# EAGLE design Flatsat v1 (EAGLE 9.6.2)
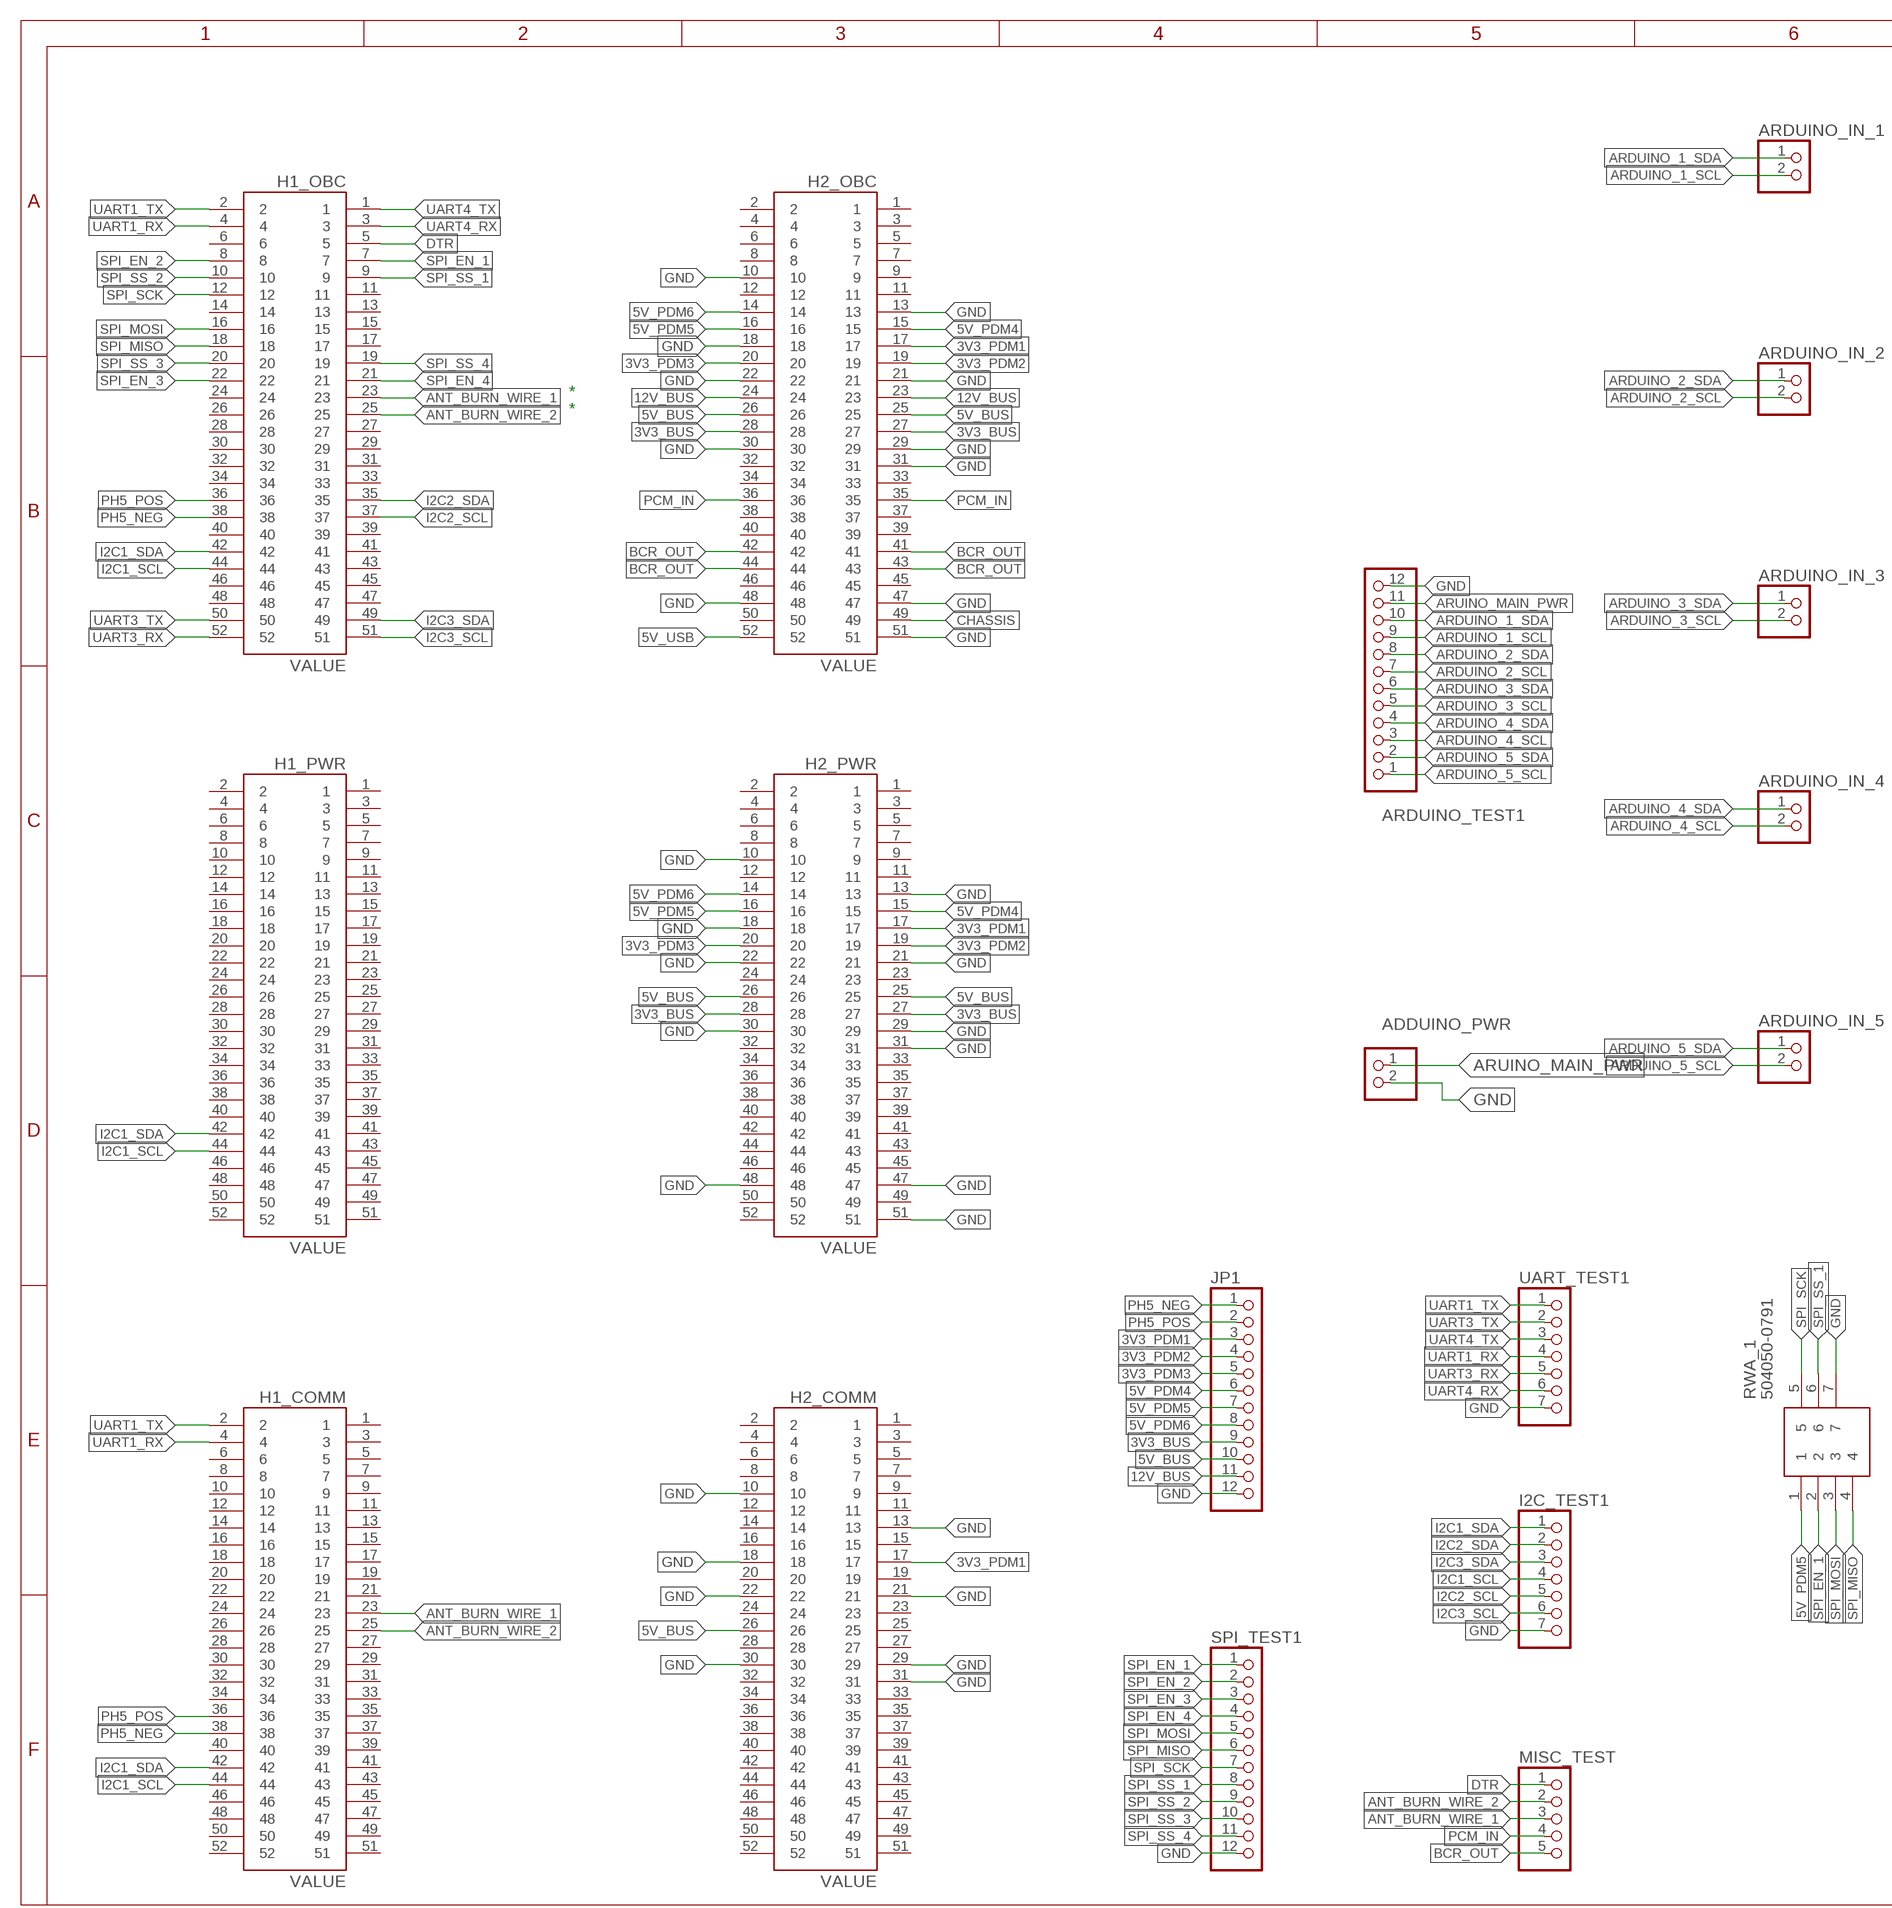
[diagram p0: schematic, sheet 1, part 1 of 2]
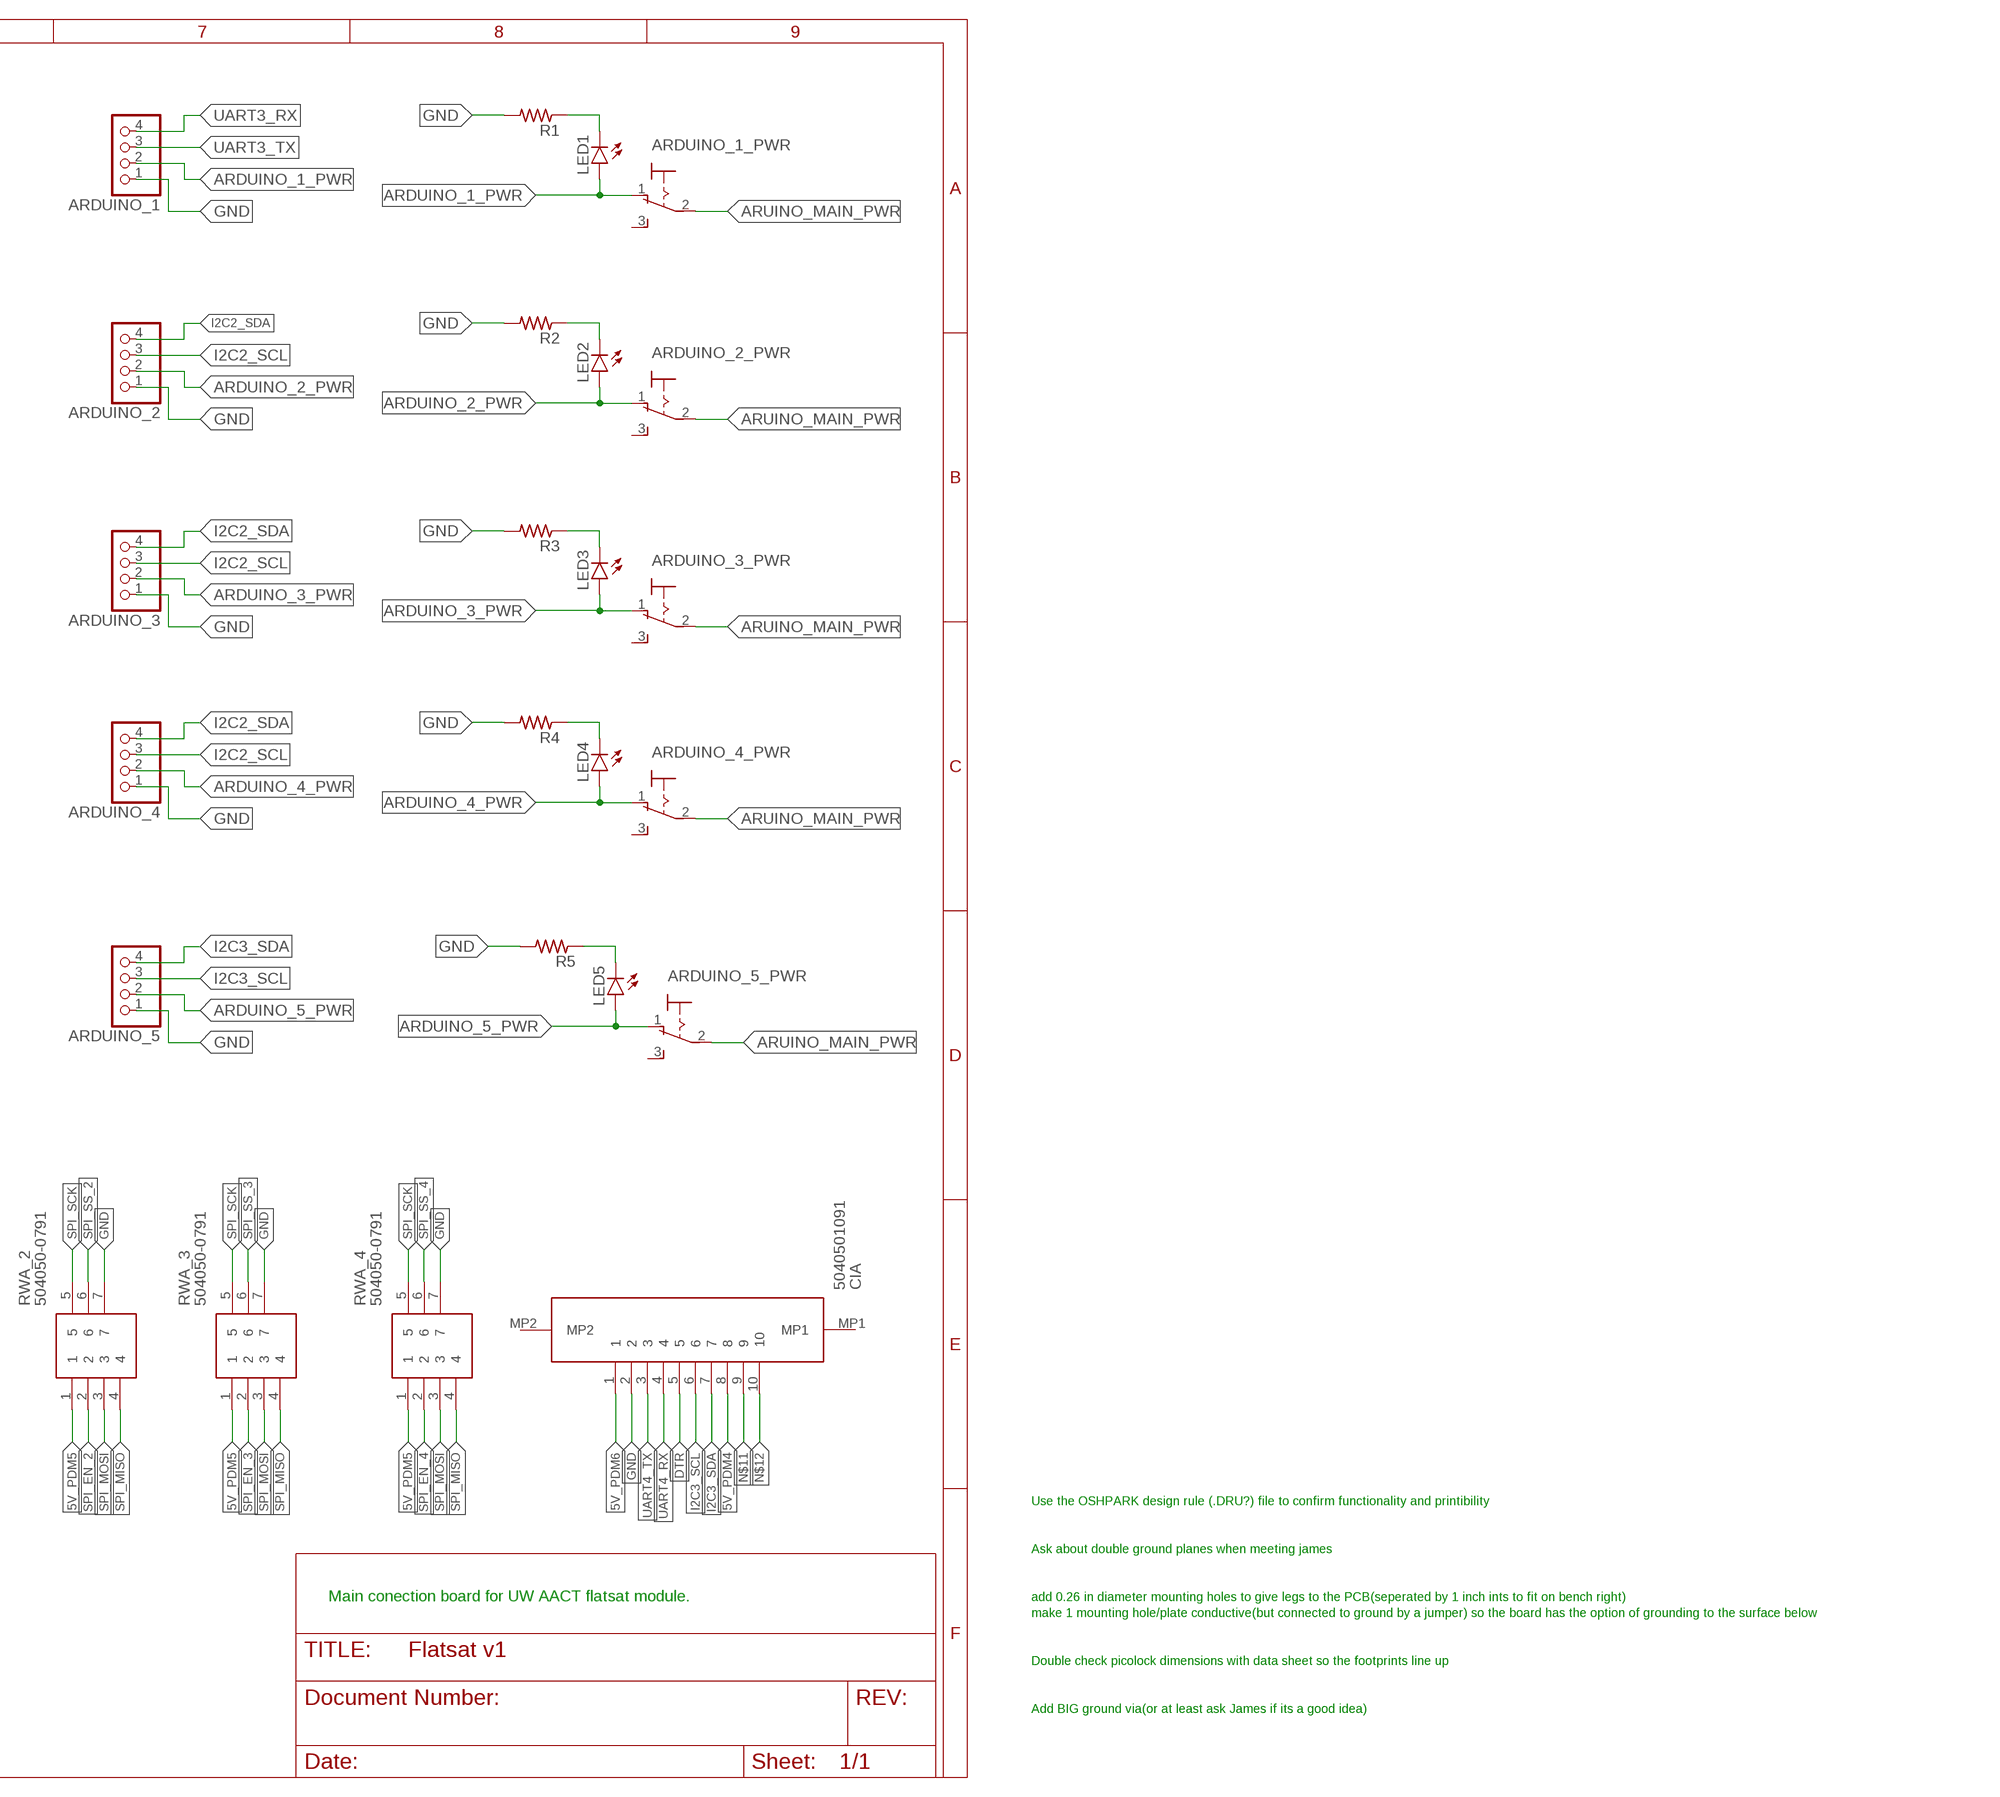
[diagram p1: schematic, sheet 1, part 2 of 2]

## Parts
ADDUINO_PWR  PINHD-1X2  [1X02]
ARDUINO_1  PINHD-1X4  [1X04]
ARDUINO_1_PWR  M9040P  [M9040P]
ARDUINO_2  PINHD-1X4  [1X04]
ARDUINO_2_PWR  M9040P  [M9040P]
ARDUINO_3  PINHD-1X4  [1X04]
ARDUINO_3_PWR  M9040P  [M9040P]
ARDUINO_4  PINHD-1X4  [1X04]
ARDUINO_4_PWR  M9040P  [M9040P]
ARDUINO_5  PINHD-1X4  [1X04]
ARDUINO_5_PWR  M9040P  [M9040P]
ARDUINO_IN_1  PINHD-1X2  [1X02]
ARDUINO_IN_2  PINHD-1X2  [1X02]
ARDUINO_IN_3  PINHD-1X2  [1X02]
ARDUINO_IN_4  PINHD-1X2  [1X02]
ARDUINO_IN_5  PINHD-1X2  [1X02]
ARDUINO_TEST1  PINHD-1X12  [1X12]
CIA  5040501091  [5040501091]
H1_COMM  ESQ-126-39-G-D_ESQ-126-39-G-D  [ESQ-126-39-G-D_SAMTEC_ESQ-126-39-G-D]
H1_OBC  ESQ-126-39-G-D_ESQ-126-39-G-D  [ESQ-126-39-G-D_SAMTEC_ESQ-126-39-G-D]
H1_PWR  ESQ-126-39-G-D_ESQ-126-39-G-D  [ESQ-126-39-G-D_SAMTEC_ESQ-126-39-G-D]
H2_COMM  ESQ-126-39-G-D_ESQ-126-39-G-D  [ESQ-126-39-G-D_SAMTEC_ESQ-126-39-G-D]
H2_OBC  ESQ-126-39-G-D_ESQ-126-39-G-D  [ESQ-126-39-G-D_SAMTEC_ESQ-126-39-G-D]
H2_PWR  ESQ-126-39-G-D_ESQ-126-39-G-D  [ESQ-126-39-G-D_SAMTEC_ESQ-126-39-G-D]
I2C_TEST1  PINHD-1X7  [1X07]
JP1  PINHD-1X12  [1X12]
LED1  TLLR4400  [LED3MM]
LED2  TLLR4400  [LED3MM]
LED3  TLLR4400  [LED3MM]
LED4  TLLR4400  [LED3MM]
LED5  TLLR4400  [LED3MM]
MISC_TEST  PINHD-1X5  [1X05]
R1  R-US_R0805W  [R0805W]
R2  R-US_R0805W  [R0805W]
R3  R-US_R0805W  [R0805W]
R4  R-US_R0805W  [R0805W]
R5  R-US_R0805W  [R0805W]
RWA_1  504050-0791  [504050-0791]
RWA_2  504050-0791  [504050-0791]
RWA_3  504050-0791  [504050-0791]
RWA_4  504050-0791  [504050-0791]
SPI_TEST1  PINHD-1X12  [1X12]
UART_TEST1  PINHD-1X7  [1X07]

## Nets
3V3_BUS [Power Line]: H2_OBC.27 H2_OBC.28 H2_PWR.27 H2_PWR.28 JP1.9
3V3_PDM1 [Power Line]: H2_COMM.17 H2_OBC.17 H2_PWR.17 JP1.3
3V3_PDM2 [Power Line]: H2_OBC.19 H2_PWR.19 JP1.4
3V3_PDM3 [Power Line]: H2_OBC.20 H2_PWR.20 JP1.5
5V_BUS [Power Line]: H2_COMM.26 H2_OBC.25 H2_OBC.26 H2_PWR.25 H2_PWR.26 JP1.10
5V_PDM4 [Power Line]: CIA.8 H2_OBC.15 H2_PWR.15 JP1.6
5V_PDM5 [Power Line]: H2_OBC.16 H2_PWR.16 JP1.7 RWA_1.1 RWA_2.1 RWA_3.1 RWA_4.1
5V_PDM6 [Power Line]: CIA.1 H2_OBC.14 H2_PWR.14 JP1.8
5V_USB [Power Line]: H2_OBC.52
12V_BUS [Power Line]: H2_OBC.23 H2_OBC.24 JP1.11
ANT_BURN_WIRE_1: H1_COMM.23 H1_OBC.23 MISC_TEST.3
ANT_BURN_WIRE_2: H1_COMM.25 H1_OBC.25 MISC_TEST.2
ARDUINO_1_PWR: ARDUINO_1.2 ARDUINO_1_PWR.1(O) LED1.A
ARDUINO_1_SCL [Signal Line]: ARDUINO_IN_1.2 ARDUINO_TEST1.9
ARDUINO_1_SDA [Signal Line]: ARDUINO_IN_1.1 ARDUINO_TEST1.10
ARDUINO_2_PWR [Signal Line]: ARDUINO_2.2 ARDUINO_2_PWR.1(O) LED2.A
ARDUINO_2_SCL: ARDUINO_IN_2.2 ARDUINO_TEST1.7
ARDUINO_2_SDA: ARDUINO_IN_2.1 ARDUINO_TEST1.8
ARDUINO_3_PWR [Signal Line]: ARDUINO_3.2 ARDUINO_3_PWR.1(O) LED3.A
ARDUINO_3_SCL: ARDUINO_IN_3.2 ARDUINO_TEST1.5
ARDUINO_3_SDA: ARDUINO_IN_3.1 ARDUINO_TEST1.6
ARDUINO_4_PWR [Signal Line]: ARDUINO_4.2 ARDUINO_4_PWR.1(O) LED4.A
ARDUINO_4_SCL: ARDUINO_IN_4.2 ARDUINO_TEST1.3
ARDUINO_4_SDA: ARDUINO_IN_4.1 ARDUINO_TEST1.4
ARDUINO_5_PWR [Signal Line]: ARDUINO_5.2 ARDUINO_5_PWR.1(O) LED5.A
ARDUINO_5_SCL: ARDUINO_IN_5.2 ARDUINO_TEST1.1
ARDUINO_5_SDA: ARDUINO_IN_5.1 ARDUINO_TEST1.2
ARUINO_MAIN_PWR [Power Line]: ADDUINO_PWR.1 ARDUINO_1_PWR.2(P) ARDUINO_2_PWR.2(P) ARDUINO_3_PWR.2(P) ARDUINO_4_PWR.2(P) ARDUINO_5_PWR.2(P) ARDUINO_TEST1.11
BCR_OUT: H2_OBC.41 H2_OBC.42 H2_OBC.43 H2_OBC.44 MISC_TEST.5
CHASSIS [Power Line]: H2_OBC.49
DTR: CIA.5 H1_OBC.5 MISC_TEST.1
GND [Power Line]: ADDUINO_PWR.2 ARDUINO_1.1 ARDUINO_2.1 ARDUINO_3.1 ARDUINO_4.1 ARDUINO_5.1 ARDUINO_TEST1.12 CIA.2 H2_COMM.10 H2_COMM.13 H2_COMM.18 H2_COMM.21 H2_COMM.22 H2_COMM.29 H2_COMM.30 H2_COMM.31 H2_OBC.10 H2_OBC.13 H2_OBC.18 H2_OBC.21 H2_OBC.22 H2_OBC.29 H2_OBC.30 H2_OBC.31 H2_OBC.47 H2_OBC.48 H2_OBC.51 H2_PWR.10 H2_PWR.13 H2_PWR.18 H2_PWR.21 H2_PWR.22 H2_PWR.29 H2_PWR.30 H2_PWR.31 H2_PWR.47 H2_PWR.48 H2_PWR.51 I2C_TEST1.7 JP1.12 R1.2 R2.2 R3.2 R4.2 R5.2 RWA_1.7 RWA_2.7 RWA_3.7 RWA_4.7 SPI_TEST1.12 UART_TEST1.7
I2C1_SCL [Signal Line]: H1_COMM.44 H1_OBC.44 H1_PWR.44 I2C_TEST1.4
I2C1_SDA [Signal Line]: H1_COMM.42 H1_OBC.42 H1_PWR.42 I2C_TEST1.1
I2C2_SCL [Signal Line]: ARDUINO_2.3 ARDUINO_3.3 ARDUINO_4.3 H1_OBC.37 I2C_TEST1.5
I2C2_SDA [Signal Line]: ARDUINO_2.4 ARDUINO_3.4 ARDUINO_4.4 H1_OBC.35 I2C_TEST1.2
I2C3_SCL [Signal Line]: ARDUINO_5.3 CIA.6 H1_OBC.51 I2C_TEST1.6
I2C3_SDA [Signal Line]: ARDUINO_5.4 CIA.7 H1_OBC.49 I2C_TEST1.3
N$1: LED2.K(C) R2.1
N$2: LED1.K(C) R1.1
N$3: LED3.K(C) R3.1
N$4: LED4.K(C) R4.1
N$5: LED5.K(C) R5.1
N$11: CIA.9
N$12: CIA.10
PCM_IN: H2_OBC.35 H2_OBC.36 MISC_TEST.4
PH5_NEG: H1_COMM.38 H1_OBC.38 JP1.1
PH5_POS: H1_COMM.36 H1_OBC.36 JP1.2
SPI_EN_1 [Signal Line]: H1_OBC.7 RWA_1.2 SPI_TEST1.1
SPI_EN_2 [Signal Line]: H1_OBC.8 RWA_2.2 SPI_TEST1.2
SPI_EN_3 [Signal Line]: H1_OBC.22 RWA_3.2 SPI_TEST1.3
SPI_EN_4 [Signal Line]: H1_OBC.21 RWA_4.2 SPI_TEST1.4
SPI_MISO: H1_OBC.18 RWA_1.4 RWA_2.4 RWA_3.4 RWA_4.4 SPI_TEST1.6
SPI_MOSI [Signal Line]: H1_OBC.16 RWA_1.3 RWA_2.3 RWA_3.3 RWA_4.3 SPI_TEST1.5
SPI_SCK [Signal Line]: H1_OBC.12 RWA_1.5 RWA_2.5 RWA_3.5 RWA_4.5 SPI_TEST1.7
SPI_SS_1 [Signal Line]: H1_OBC.9 RWA_1.6 SPI_TEST1.8
SPI_SS_2 [Signal Line]: H1_OBC.10 RWA_2.6 SPI_TEST1.9
SPI_SS_3 [Signal Line]: H1_OBC.20 RWA_3.6 SPI_TEST1.10
SPI_SS_4 [Signal Line]: H1_OBC.19 RWA_4.6 SPI_TEST1.11
UART1_RX: H1_COMM.4 H1_OBC.4 UART_TEST1.4
UART1_TX: H1_COMM.2 H1_OBC.2 UART_TEST1.1
UART3_RX: ARDUINO_1.4 H1_OBC.52 UART_TEST1.5
UART3_TX [Signal Line]: ARDUINO_1.3 H1_OBC.50 UART_TEST1.2
UART4_RX: CIA.4 H1_OBC.3 UART_TEST1.6
UART4_TX: CIA.3 H1_OBC.1 UART_TEST1.3
Unconnected: ARDUINO_1_PWR.3(S) ARDUINO_2_PWR.3(S) ARDUINO_3_PWR.3(S) ARDUINO_4_PWR.3(S) ARDUINO_5_PWR.3(S) CIA.MP1 CIA.MP2 H1_COMM.1 H1_COMM.3 H1_COMM.5 H1_COMM.6 H1_COMM.7 H1_COMM.8 H1_COMM.9 H1_COMM.10 H1_COMM.11 H1_COMM.12 H1_COMM.13 H1_COMM.14 H1_COMM.15 H1_COMM.16 H1_COMM.17 H1_COMM.18 H1_COMM.19 H1_COMM.20 H1_COMM.21 H1_COMM.22 H1_COMM.24 H1_COMM.26 H1_COMM.27 H1_COMM.28 H1_COMM.29 H1_COMM.30 H1_COMM.31 H1_COMM.32 H1_COMM.33 H1_COMM.34 H1_COMM.35 H1_COMM.37 H1_COMM.39 H1_COMM.40 H1_COMM.41 H1_COMM.43 H1_COMM.45 H1_COMM.46 H1_COMM.47 H1_COMM.48 H1_COMM.49 H1_COMM.50 H1_COMM.51 H1_COMM.52 H1_OBC.6 H1_OBC.11 H1_OBC.13 H1_OBC.14 H1_OBC.15 H1_OBC.17 H1_OBC.24 H1_OBC.26 H1_OBC.27 H1_OBC.28 H1_OBC.29 H1_OBC.30 H1_OBC.31 H1_OBC.32 H1_OBC.33 H1_OBC.34 H1_OBC.39 H1_OBC.40 H1_OBC.41 H1_OBC.43 H1_OBC.45 H1_OBC.46 H1_OBC.47 H1_OBC.48 H1_PWR.1 H1_PWR.2 H1_PWR.3 H1_PWR.4 H1_PWR.5 H1_PWR.6 H1_PWR.7 H1_PWR.8 H1_PWR.9 H1_PWR.10 H1_PWR.11 H1_PWR.12 H1_PWR.13 H1_PWR.14 H1_PWR.15 H1_PWR.16 H1_PWR.17 H1_PWR.18 H1_PWR.19 H1_PWR.20 H1_PWR.21 H1_PWR.22 H1_PWR.23 H1_PWR.24 H1_PWR.25 H1_PWR.26 H1_PWR.27 H1_PWR.28 H1_PWR.29 H1_PWR.30 H1_PWR.31 H1_PWR.32 H1_PWR.33 H1_PWR.34 H1_PWR.35 H1_PWR.36 H1_PWR.37 H1_PWR.38 H1_PWR.39 H1_PWR.40 H1_PWR.41 H1_PWR.43 H1_PWR.45 H1_PWR.46 H1_PWR.47 H1_PWR.48 H1_PWR.49 H1_PWR.50 H1_PWR.51 H1_PWR.52 H2_COMM.1 H2_COMM.2 H2_COMM.3 H2_COMM.4 H2_COMM.5 H2_COMM.6 H2_COMM.7 H2_COMM.8 H2_COMM.9 H2_COMM.11 H2_COMM.12 H2_COMM.14 H2_COMM.15 H2_COMM.16 H2_COMM.19 H2_COMM.20 H2_COMM.23 H2_COMM.24 H2_COMM.25 H2_COMM.27 H2_COMM.28 H2_COMM.32 H2_COMM.33 H2_COMM.34 H2_COMM.35 H2_COMM.36 H2_COMM.37 H2_COMM.38 H2_COMM.39 H2_COMM.40 H2_COMM.41 H2_COMM.42 H2_COMM.43 H2_COMM.44 H2_COMM.45 H2_COMM.46 H2_COMM.47 H2_COMM.48 H2_COMM.49 H2_COMM.50 H2_COMM.51 H2_COMM.52 H2_OBC.1 H2_OBC.2 H2_OBC.3 H2_OBC.4 H2_OBC.5 H2_OBC.6 H2_OBC.7 H2_OBC.8 H2_OBC.9 H2_OBC.11 H2_OBC.12 H2_OBC.32 H2_OBC.33 H2_OBC.34 H2_OBC.37 H2_OBC.38 H2_OBC.39 H2_OBC.40 H2_OBC.45 H2_OBC.46 H2_OBC.50 H2_PWR.1 H2_PWR.2 H2_PWR.3 H2_PWR.4 H2_PWR.5 H2_PWR.6 H2_PWR.7 H2_PWR.8 H2_PWR.9 H2_PWR.11 H2_PWR.12 H2_PWR.23 H2_PWR.24 H2_PWR.32 H2_PWR.33 H2_PWR.34 H2_PWR.35 H2_PWR.36 H2_PWR.37 H2_PWR.38 H2_PWR.39 H2_PWR.40 H2_PWR.41 H2_PWR.42 H2_PWR.43 H2_PWR.44 H2_PWR.45 H2_PWR.46 H2_PWR.49 H2_PWR.50 H2_PWR.52

## Notes on the sheet
- *
- *
- Use the OSHPARK design rule (.DRU?) file to confirm functionality and printibility
- Ask about double ground planes when meeting james
- Main conection board for UW AACT flatsat module. | add 0.26 in diameter mounting holes to give legs to the PCB(seperated by 1 inch ints to fit on bench right)
- make 1 mounting hole/plate conductive(but connected to ground by a jumper) so the board has the option of grounding to the surface below
- Double check picolock dimensions with data sheet so the footprints line up
- Add BIG ground via(or at least ask James if its a good idea)

## Library data of the parts
ADDUINO_PWR ARDUINO_IN_1-ARDUINO_IN_5 = pinhead:PINHD-1X2: PIN HEADER
ARDUINO_1-ARDUINO_5 = pinhead:PINHD-1X4: PIN HEADER
ARDUINO_1_PWR ARDUINO_2_PWR ARDUINO_3_PWR ARDUINO_4_PWR ARDUINO_5_PWR = switch:M9040P: TOGGLE SWITCH Marquardt
ARDUINO_TEST1 JP1 SPI_TEST1 = pinhead:PINHD-1X12: PIN HEADER
CIA = 5040501091:5040501091: 1.50mm Pitch, Pico-Lock PCB Header, Dual Row, Right-Angle, Surface Mount, Gold over Nickel Plating, Positive Lock, Circuits Source: Datasheet <https://www.molex.com/pdm_docs/sd/5040500691_sd.pdf>; ARROW_PART_NUMBER: 5040501091; ARROW_PRICE-STOCK: https://www.arrow.com/en/products/5040501091/molex; DESCRIPTION: 1.50mm Pitch, Pico-Lock PCB Header, Dual Row, Right-Angle, Surface Mount, Gold over Nickel Plating, Positive Lock, Circuits; HEIGHT: 2.15mm; MANUFACTURER_NAME: Molex; MANUFACTURER_PART_NUMBER: 5040501091
H1_COMM H1_OBC H1_PWR H2_COMM H2_OBC H2_PWR = EPS Flatsat Module2:ESQ-126-39-G-D_ESQ-126-39-G-D: Conn Elevated Socket SKT 52 POS 2.54mm Solder ST Thru-Hole Tube; DESCRIPTION: 52 Position Elevated Socket Connector Through Hole; DIGI-KEY_PART_NUMBER: SAM10462-ND; DIGI-KEY_PURCHASE_URL: https://www.digikey.com/product-detail/en/samtec-inc/ESQ-126-39-G-D/SAM10462-ND/3601055?utm_source=snapeda&utm_medium=aggregator&utm_campaign=symbol; MF: Samtec; MP: ESQ-126-39-G-D; PACKAGE: None
I2C_TEST1 UART_TEST1 = pinhead:PINHD-1X7: PIN HEADER
LED1-LED5 = led:TLLR4400: Low Current (2mA) LED 3 mm Tinted Diffused Package color RED Source: Data sheet <http://www.farnell.com/datasheets/391100.pdf>; MF: VISHAY SEMICONDUCTOR; OC_FARNELL: 1612437
MISC_TEST = pinhead:PINHD-1X5: PIN HEADER
R1-R5 = rcl:R-US_: RESISTOR, American symbol; SPICEPREFIX: R
RWA_1-RWA_4 = 504050-0791:504050-0791: Molex 504050 Series, 1.5mm Pitch 7 Way 1 Row Right Angle PCB Header, SMT Termination, 3A Source: Datasheet <https://componentsearchengine.com/Datasheets/3/504050-0791.pdf>; DESCRIPTION: Molex 504050 Series, 1.5mm Pitch 7 Way 1 Row Right Angle PCB Header, SMT Termination, 3A; HEIGHT: mm; MANUFACTURER_NAME: Molex; MANUFACTURER_PART_NUMBER: 504050-0791; MOUSER_PART_NUMBER: 538-504050-0791; MOUSER_PRICE-STOCK: https://www.mouser.co.uk/ProductDetail/Molex/504050-0791/?qs=bvCPb%252BE7ys0LP7A0OZeD8A%3D%3D

## Net classes
0 default: width 0.305 mm
1 Power Line: width 0.356 mm
2 Signal Line: width 0.254 mm

## Board
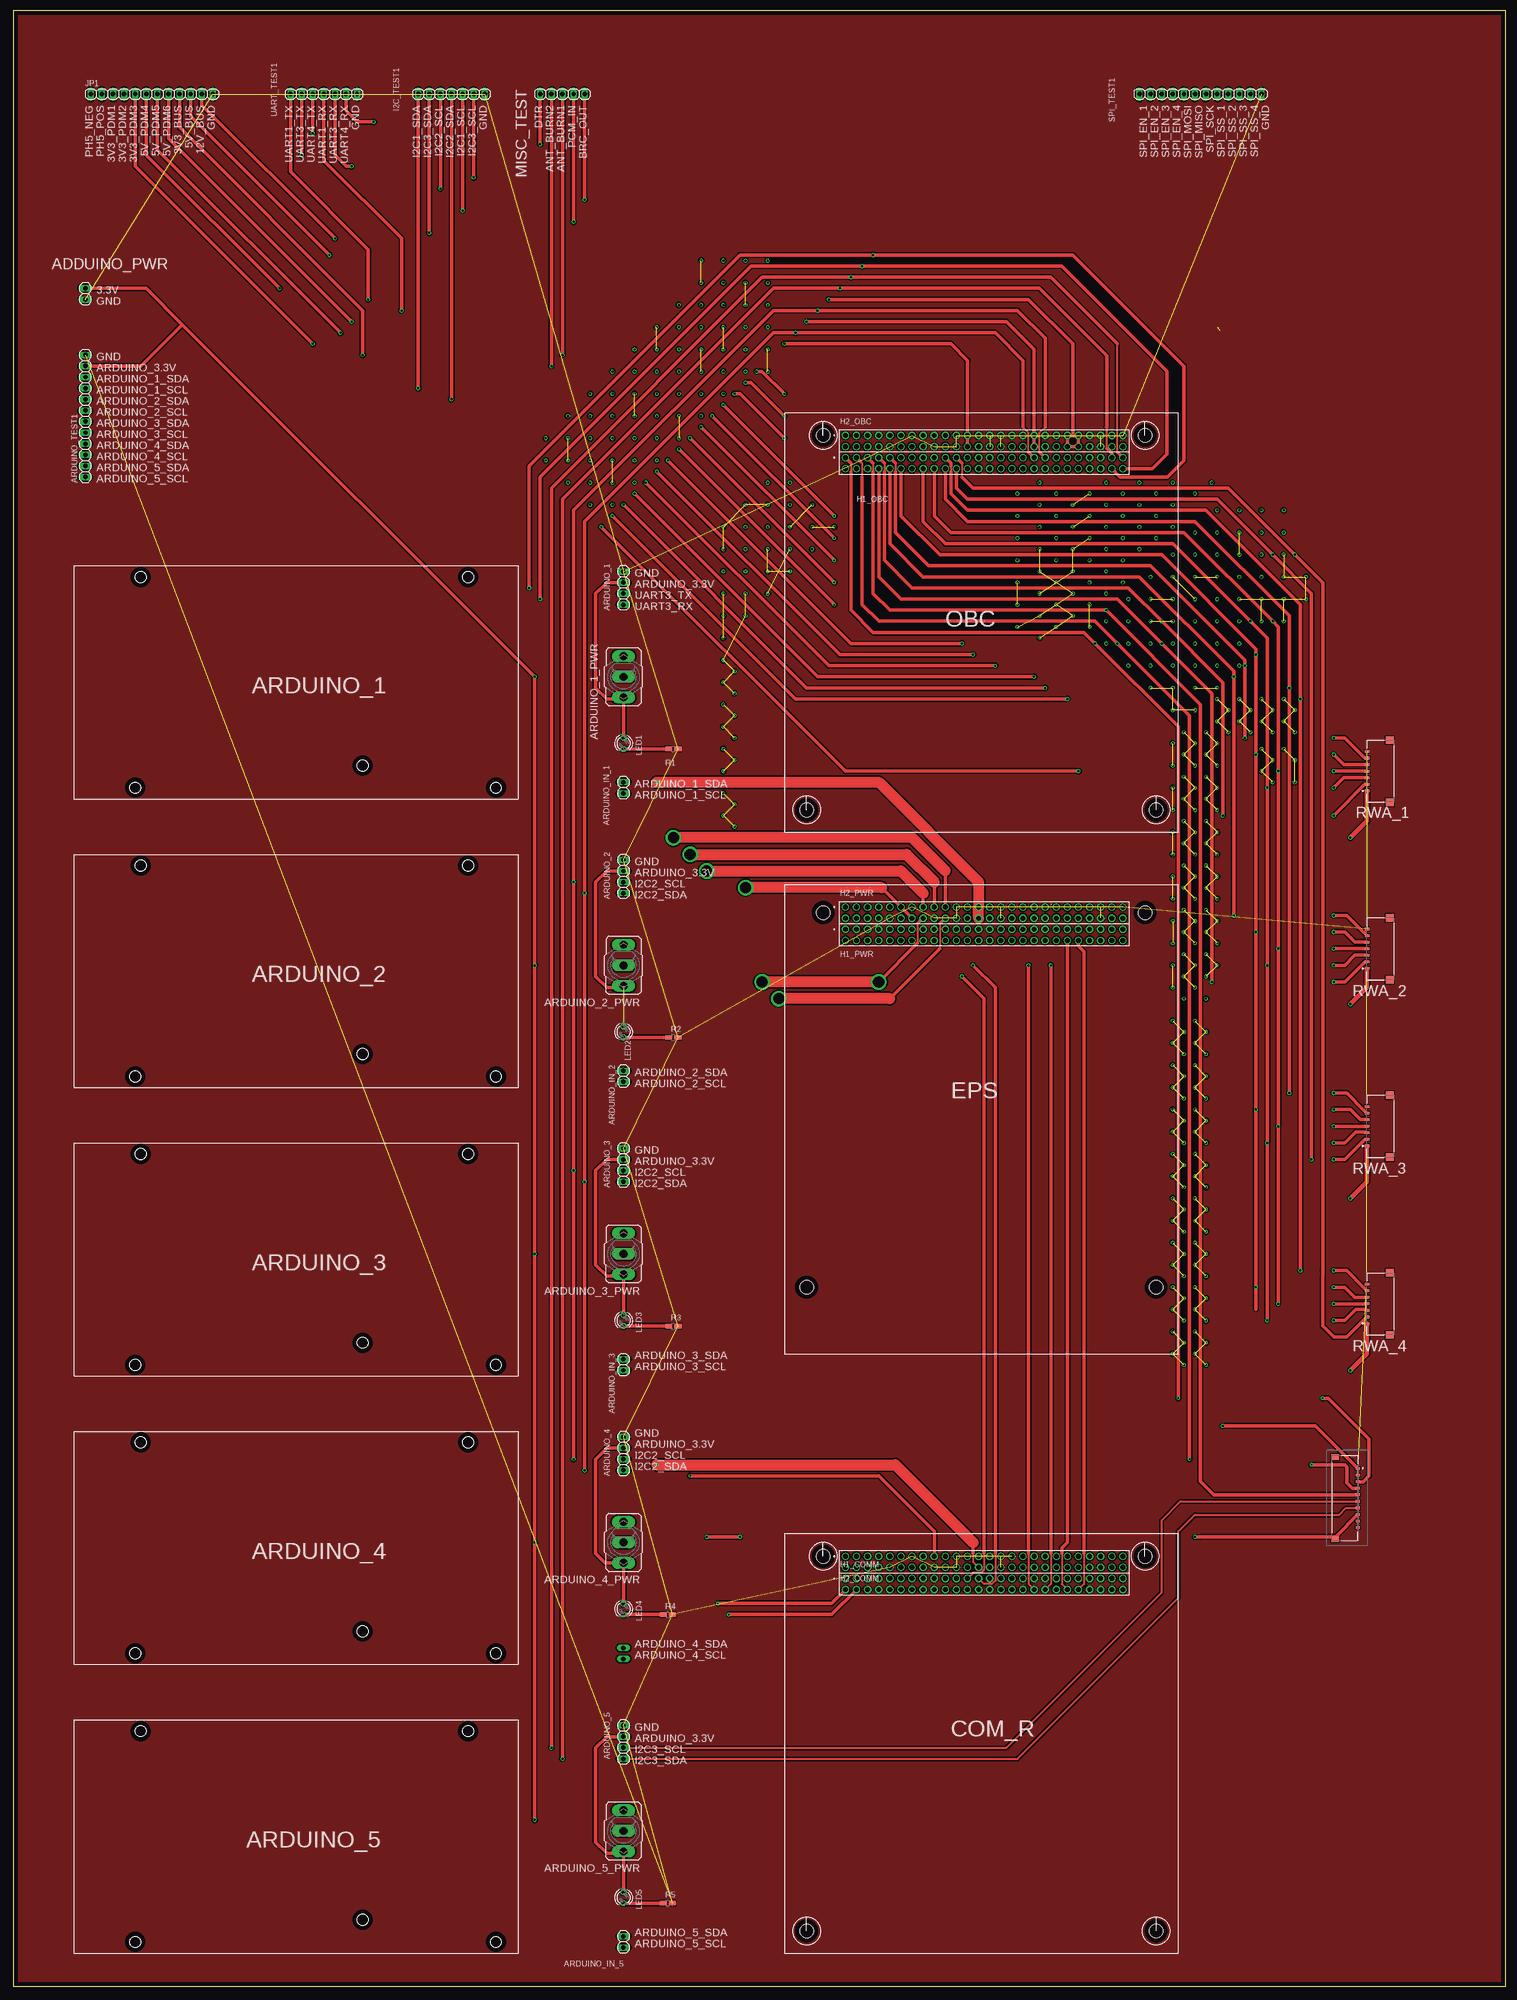
[diagram p2: board, top side]
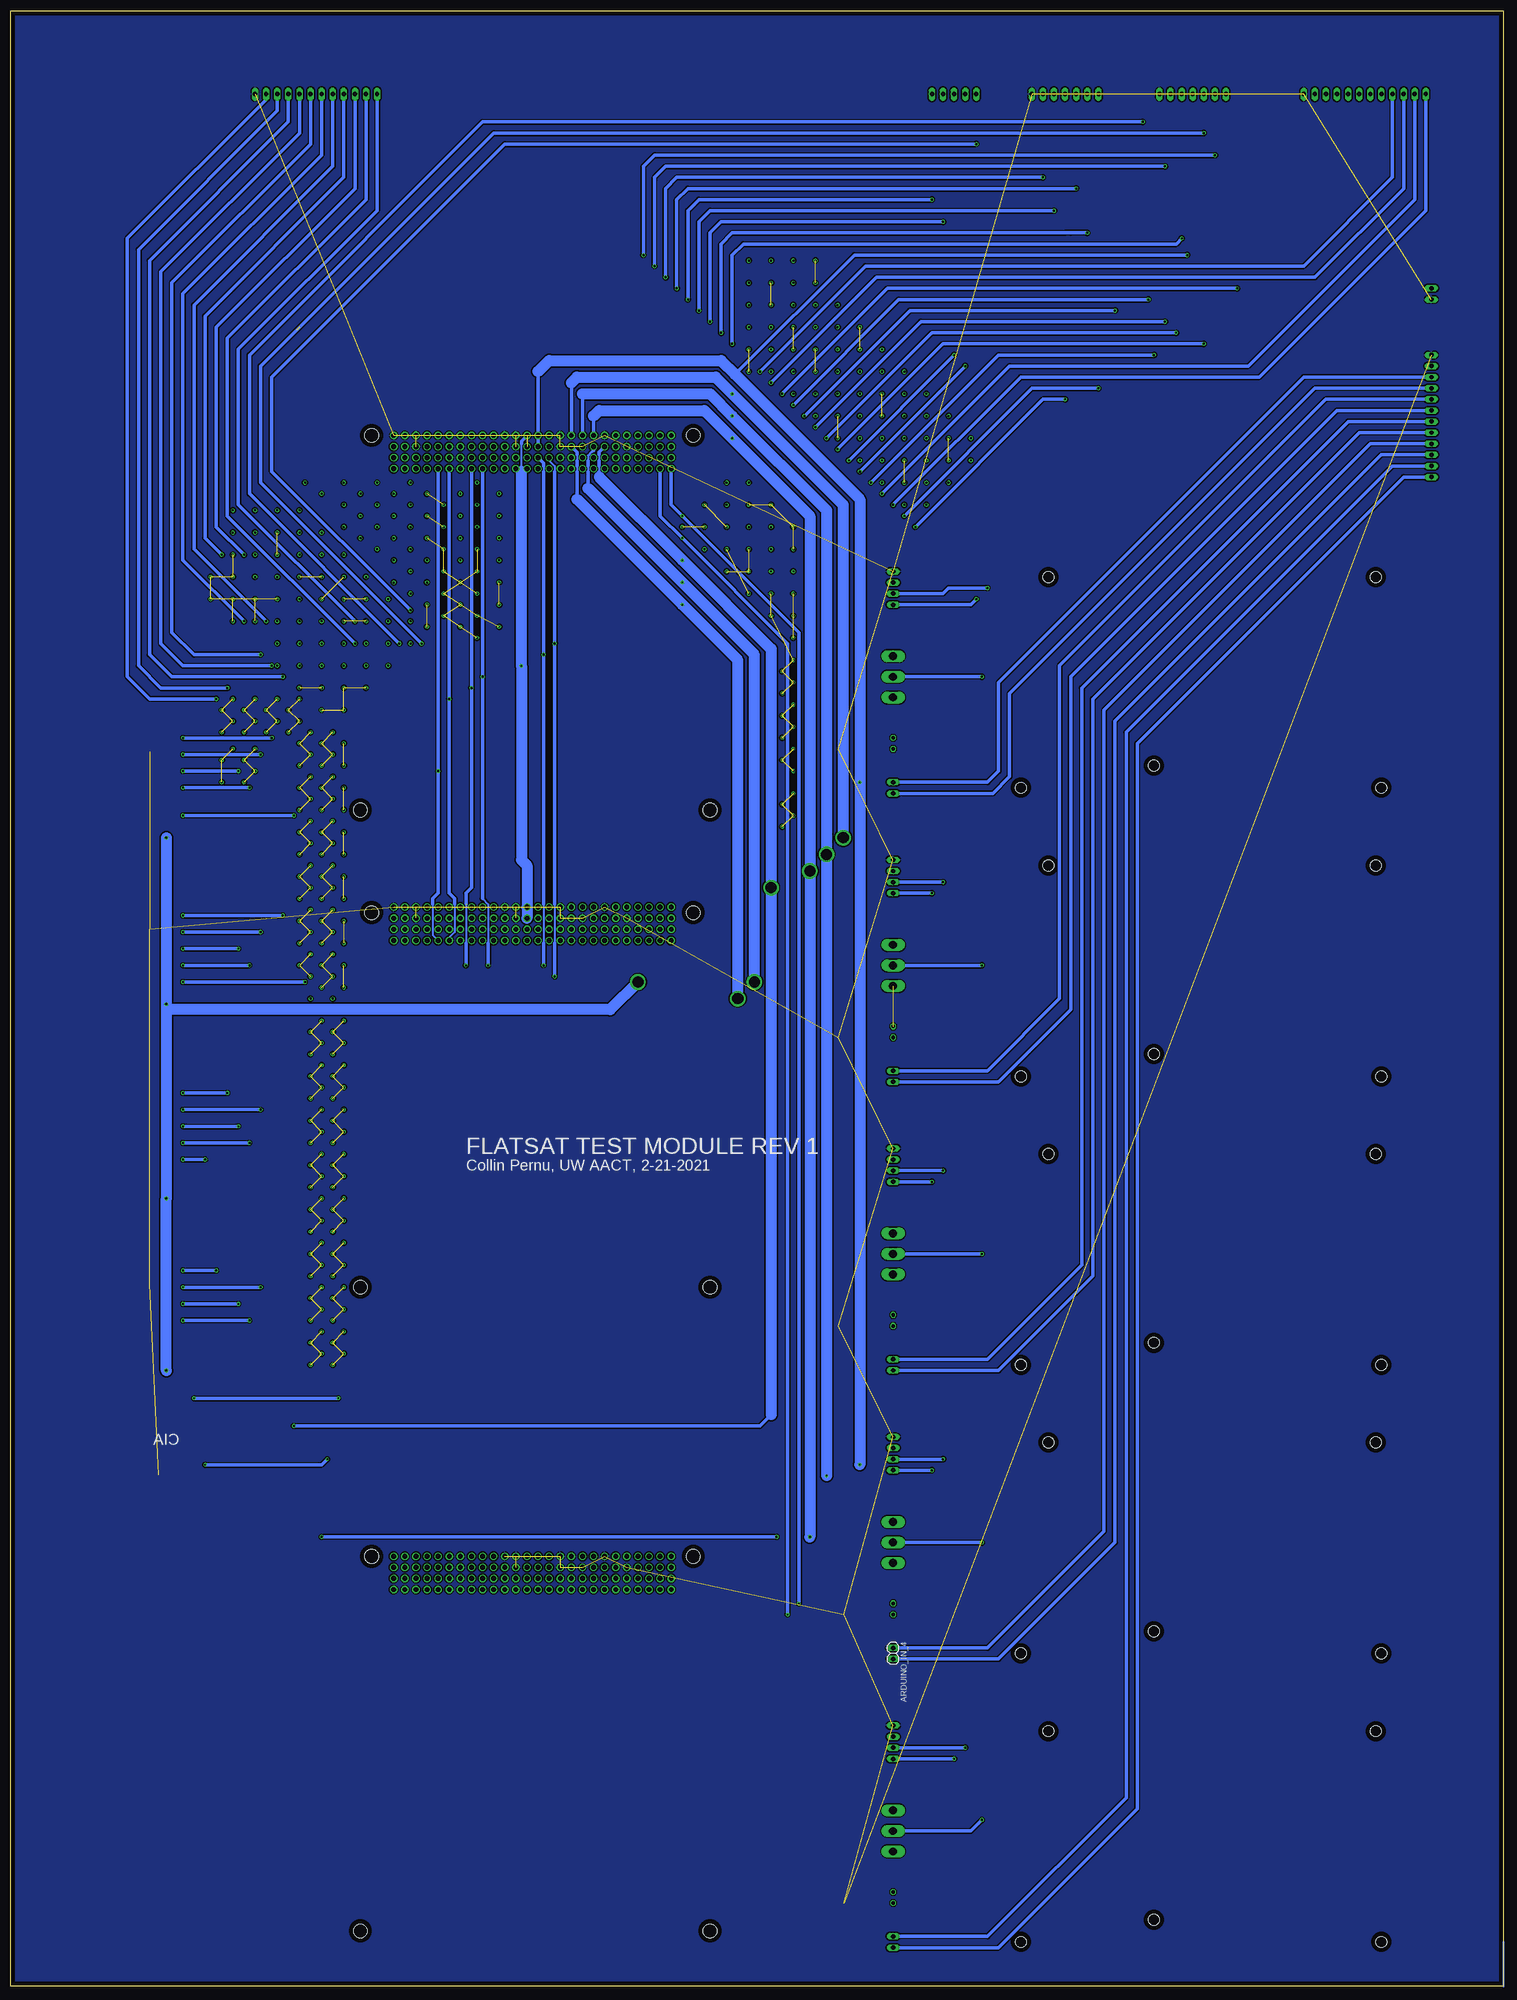
[diagram p3: board, bottom side, seen from below]

Size 341.63 x 452.12 mm. Coordinates in mm from the lower left corner, seen from the top.
Outline: 0,0 341.63,0 341.63,452.12 0,452.12 0,0
Copper layers (1*16): Top 0.035mm / dielectric 1.5mm / Bottom 0.035mm
Design rules "default": minimum track width 6mil, minimum drill 0.35mm, track to track 6mil, track to pad 6mil, pad to pad 6mil, via to via 6mil, smd to smd 6mil, copper to edge 40mil, drill to drill 6mil, minimum pad ring 10mil, minimum via ring 8mil, stop-mask expansion 4mil, vias tented up to drill 0mil, thermal gap 10mil
Holes 3.17 mm at 259.08,354.96 185.42,354.96 261.62,269.24 181.61,269.24 185.42,98.42 259.08,98.42 261.62,12.7 181.61,12.7 185.42,245.75 259.08,245.75 261.62,160.02 181.61,160.02
Holes 2.54 mm at 110.49,10.16 80.01,15.24 27.94,10.16 29.21,58.42 104.14,58.42 80.01,81.28 110.49,76.2 104.14,124.46 110.49,142.24 80.01,147.32 27.94,142.24 29.21,190.5 29.21,124.46 27.94,76.2 104.14,190.5 110.49,208.28 80.01,213.36 27.94,208.28 29.21,256.54 104.14,256.54 110.49,274.32 80.01,279.4 27.94,274.32 29.21,322.58 104.14,322.58

### Footprints (pad centres in the part's own frame; a part is rotated, then mirrored left to right if it is on the bottom)
1X02 = drill 1.016 long: 1 -1.27,0; 2 1.27,0
1X04 = drill 1.016 long: 1 -3.81,0; 2 -1.27,0; 3 1.27,0; 4 3.81,0
M9040P = drill 1.803 long: 1 0,4.699; 2 0,0; 3 0,-4.699
1X12 = drill 1.016 long: 1 -13.97,0; 2 -11.43,0; 3 -8.89,0; 4 -6.35,0; 5 -3.81,0; 6 -1.27,0; 7 1.27,0; 8 3.81,0; 9 6.35,0; 10 8.89,0; 11 11.43,0; 12 13.97,0
5040501091 = smd 0.6 x 1: 1 6.75,-2.975; 2 5.25,-2.975; 3 3.75,-2.975; 4 2.25,-2.975; 5 0.75,-2.975; 6 -0.75,-2.975; 7 -2.25,-2.975; 8 -3.75,-2.975; 9 -5.25,-2.975; 10 -6.75,-2.975 | smd 1.25 x 1.8: MP1 -9.355,2.215; MP2 9.355,2.215
ESQ-126-39-G-D_SAMTEC_ESQ-126-39-G-D = drill 1.1: 1 0,0; 2 0,-2.54; 3 2.54,0; 4 2.54,-2.54; 5 5.08,0; 6 5.08,-2.54; 7 7.62,0; 8 7.62,-2.54; 9 10.16,0; 10 10.16,-2.54; 11 12.7,0; 12 12.7,-2.54; 13 15.24,0; 14 15.24,-2.54; 15 17.78,0; 16 17.78,-2.54; 17 20.32,0; 18 20.32,-2.54; 19 22.86,0; 20 22.86,-2.54; 21 25.4,0; 22 25.4,-2.54; 23 27.94,0; 24 27.94,-2.54; 25 30.48,0; 26 30.48,-2.54; 27 33.02,0; 28 33.02,-2.54; 29 35.56,0; 30 35.56,-2.54; 31 38.1,0; 32 38.1,-2.54; 33 40.64,0; 34 40.64,-2.54; 35 43.18,0; 36 43.18,-2.54; 37 45.72,0; 38 45.72,-2.54; 39 48.26,0; 40 48.26,-2.54; 41 50.8,0; 42 50.8,-2.54; 43 53.34,0; 44 53.34,-2.54; 45 55.88,0; 46 55.88,-2.54; 47 58.42,0; 48 58.42,-2.54; 49 60.96,0; 50 60.96,-2.54; 51 63.5,0; 52 63.5,-2.54
1X07 = drill 1.016 long: 1 -7.62,0; 2 -5.08,0; 3 -2.54,0; 4 0,0; 5 2.54,0; 6 5.08,0; 7 7.62,0
LED3MM = drill 0.813 octagon: A -1.27,0; K 1.27,0
1X05 = drill 1.016 long: 1 -5.08,0; 2 -2.54,0; 3 0,0; 4 2.54,0; 5 5.08,0
R0805W = smd 1.5 x 1: 1 -1.052,0; 2 1.052,0
504050-0791 = smd 0.6 x 1: 1 4.5,0; 2 3,0; 3 1.5,0; 4 0,0; 5 -1.5,0; 6 -3,0; 7 -4.5,0 | smd 1.68 x 1.8: 8 -7.105,5.19; 9 7.105,5.19

### Placement (x,y rotation side)
ADDUINO_PWR  16.51,387.35 270 top
ARDUINO_1  139.7,320.04 270 top
ARDUINO_1_PWR  139.7,299.72 180 top
ARDUINO_2  139.7,254 270 top
ARDUINO_2_PWR  139.7,233.68 180 top
ARDUINO_3  139.7,187.96 270 top
ARDUINO_3_PWR  139.7,167.64 180 top
ARDUINO_4  139.7,121.92 270 top
ARDUINO_4_PWR  139.7,101.6 180 top
ARDUINO_5  139.7,55.88 270 top
ARDUINO_5_PWR  139.7,35.56 180 top
ARDUINO_IN_1  139.7,274.32 270 top
ARDUINO_IN_2  139.7,208.28 270 top
ARDUINO_IN_3  139.7,142.24 270 top
ARDUINO_IN_4  139.7,76.2 270 bottom
ARDUINO_IN_5  139.7,10.16 270 top
ARDUINO_TEST1  16.51,359.41 90 top
CIA  304.8,111.76 90 top
H1_COMM  190.5,93.34 0 top
H1_OBC  190.5,349.88 0 top
H1_PWR  190.5,241.94 0 top
H2_COMM  190.5,98.42 0 top
H2_OBC  190.5,354.96 0 top
H2_PWR  190.5,247.01 0 top
I2C_TEST1  100.33,433.07 0 top
JP1  31.75,433.07 0 top
LED1  139.7,284.48 270 top
LED2  139.7,218.44 270 top
LED3  139.7,152.4 270 top
LED4  139.7,86.36 270 top
LED5  139.7,20.32 270 top
MISC_TEST  125.73,433.07 0 top
R1  151.13,283.21 0 top
R2  151.13,217.17 0 top
R3  151.13,151.13 0 top
R4  149.86,85.09 0 top
R5  149.86,19.05 0 top
RWA_1  309.88,278.13 270 top
RWA_2  309.88,237.49 270 top
RWA_3  309.88,196.85 270 top
RWA_4  309.88,156.21 270 top
SPI_TEST1  271.78,433.07 0 top
UART_TEST1  71.12,433.07 0 top

### Tracks (layer width: path | path; a pad name or v marks a point on that pad's centre or on a via)
3V3_BUS  (via drill 0.35, 0.45)  (1 unrouted)
  Top 0.762: v224.79,302.26 186.69,302.26 v144.78,344.17 | v80.01,373.38 80.01,383.54 38.1,425.45 JP1.9
  Bottom 0.508: 224.79,346.71 224.79,353.06
  Bottom 0.762: H2_OBC.27 224.79,353.69 224.79,353.06 | v144.78,344.17 115.57,373.38 v80.01,373.38
  Bottom 2.54: 224.79,346.71 v224.79,302.26 224.79,257.81 223.52,256.54 H2_PWR.27 H2_PWR.28
3V3_PDM1  (via drill 0.35, 0.4, 0.45, 2.54)
  Top 0.762: 210.82,252.73 H2_PWR.17 | v176.53,359.41 168.91,367.03 v167.64,367.03 | H2_COMM.17 210.82,104.14 198.12,116.84 v154.94,116.84
  Top 2.54: v154.94,259.08 204.47,259.08 210.82,252.73
  Bottom 0.762: H2_OBC.17 210.82,364.49 | v167.64,367.03 143.51,391.16 43.18,391.16 22.86,411.48 JP1.3
  Bottom 2.54: 210.82,364.49 181.61,364.49 v176.53,359.41 154.94,337.82 v154.94,259.08 v154.94,116.84
3V3_PDM2  (via drill 0.4, 0.45, 2.54)
  Top 0.762: H2_PWR.19 213.36,255.27 | v176.53,364.49 171.45,369.57 v170.18,369.57
  Top 2.54: v151.13,262.89 205.74,262.89 213.36,255.27
  Bottom 0.762: H2_OBC.19 213.36,367.03 | v170.18,369.57 146.05,393.7 45.72,393.7 25.4,414.02 JP1.4
  Bottom 2.54: v151.13,262.89 151.13,339.09 v176.53,364.49 180.34,368.3 212.09,368.3 213.36,367.03
3V3_PDM3  (via drill 0.35, 0.45, 2.54)
  Top 0.508: 212.09,243.21 212.09,237.49
  Top 0.762: H2_PWR.20 212.09,243.21 | 212.09,237.49 200.66,226.06 | v187.96,316.23 v152.4,351.79 | v68.58,375.92 27.94,416.56 JP1.5
  Top 2.54: 200.66,226.06 v175.26,226.06
  Bottom 0.508: 212.09,350.52 212.09,349.25 | 212.09,347.98 212.09,346.71
  Bottom 0.762: H2_OBC.20 212.09,351.15 212.09,350.52 | 212.09,349.25 212.09,347.98 | 212.09,346.71 212.09,340.36 | v152.4,351.79 128.27,375.92 v68.58,375.92
  Bottom 2.54: 212.09,340.36 v187.96,316.23 175.26,303.53 v175.26,226.06
5V_BUS  (via drill 0.35, 0.45)
  Top 0.508: 219.71,99.08 219.71,97.16 H2_COMM.26
  Top 0.762: v72.39,396.24 40.64,427.99 JP1.10 | 219.71,101.6 219.71,99.08
  Top 2.54: v147.32,275.59 198.12,275.59 220.98,252.73 H2_PWR.25 H2_PWR.26 | 219.71,101.6 201.93,119.38 v147.32,119.38
  Bottom 0.762: H2_OBC.26 H2_OBC.25 220.98,369.57 | 175.9,368.94 148.59,396.24 v72.39,396.24
  Bottom 2.54: v147.32,119.38 v147.32,275.59 147.32,340.36 175.9,368.94 179.07,372.11 218.44,372.11 220.98,369.57
5V_PDM4  (via drill 0.4, 0.45, 2.54)
  Top 0.762: 208.28,250.19 H2_PWR.15 | v176.53,354.33 166.37,364.49 v165.1,364.49 | CIA.8 302.69,102.93 271.84,102.93 271.78,102.87 v270.51,102.87 | v60.96,388.62 30.48,419.1 JP1.6 | v158.75,102.87 v166.37,102.87
  Top 2.54: v158.75,255.27 203.2,255.27 208.28,250.19
  Bottom 0.762: H2_OBC.15 208.28,359.41 | v166.37,102.87 v270.51,102.87 | v165.1,364.49 140.97,388.62 v60.96,388.62
  Bottom 2.54: 208.28,359.41 207.01,360.68 182.88,360.68 v176.53,354.33 158.75,336.55 v158.75,255.27 v158.75,102.87
5V_PDM5  (via drill 0.35, 0.45, 2.54)
  Top 0.508: 207.01,243.21 207.01,238.76
  Top 0.762: H2_PWR.16 207.01,243.21 | 207.01,238.76 v198.12,229.87 | v187.96,321.31 v154.94,354.33 | v74.93,378.46 33.02,420.37 JP1.7
  Top 1.016: RWA_2.1 309.88,228.6 v306.07,224.79 | v306.07,180.34 309.88,184.15 RWA_3.1 | RWA_1.1 309.88,266.7 v306.07,262.89 | RWA_4.1 309.88,144.78 v306.07,140.97
  Top 2.54: v198.12,229.87 v171.45,229.87
  Bottom 0.508: 209.55,347.98 209.55,346.71 | 208.28,351.52 208.68,351.12 208.79,351.12 209.55,350.36 209.55,349.25
  Bottom 0.762: H2_OBC.16 208.28,351.52 | 209.55,349.25 209.55,347.98 | 209.55,346.71 209.55,342.9 | v154.94,354.33 130.81,378.46 v74.93,378.46
  Bottom 2.54: 209.55,342.9 v187.96,321.31 171.45,304.8 v171.45,229.87 | v198.12,229.87 204.47,223.52 306.07,223.52 | v306.07,262.89 v306.07,224.79 306.07,223.52 | 306.07,223.52 v306.07,180.34 v306.07,140.97
5V_PDM6  (via drill 0.35, 0.45, 2.54)
  Top 0.762: H2_PWR.14 198.75,251.46 | CIA.1 298.01,128.27 v276.86,128.27 | v187.96,326.39 v157.48,356.87 | v77.47,381 35.56,422.91 JP1.8
  Top 2.54: 198.75,251.46 v167.64,251.46
  Bottom 0.508: 207.01,347.98 207.01,346.71 | 207.01,350.52 207.01,349.25
  Bottom 0.762: H2_OBC.14 207.01,351.15 207.01,350.52 | 207.01,349.25 207.01,347.98 | 207.01,346.71 207.01,345.44 | 167.64,130.81 170.18,128.27 v276.86,128.27 | v157.48,356.87 133.35,381 v77.47,381
  Bottom 2.54: 207.01,345.44 v187.96,326.39 167.64,306.07 v167.64,251.46 167.64,130.81
12V_BUS  (via drill 0.45)
  Top 0.762: H2_OBC.24 H2_OBC.23 218.44,372.11 214.63,375.92 v176.53,375.92 | v73.66,400.05 43.18,430.53 JP1.11
  Bottom 0.762: v176.53,375.92 176.53,396.24 173.99,398.78 74.93,398.78 v73.66,400.05
ANT_BURN_WIRE_1  (via drill 0.45)
  Top 0.508: H1_COMM.23 219.75,94.65 221.49,94.65 222.25,95.41 222.25,99.08
  Top 0.762: v149.86,349.25 159.38,339.73 191.77,307.34 v217.17,307.34 | MISC_TEST.3 v125.73,373.38 | v217.17,231.14 222.25,226.06 222.25,99.08
  Bottom 0.508: 217.17,247.67 217.17,238.76 | 217.17,346.71 217.17,347.98 218.44,349.25 H1_OBC.23
  Bottom 0.762: 217.17,346.71 v217.17,307.34 217.17,247.67 | v149.86,349.25 v125.73,373.38 | 217.17,238.76 v217.17,231.14
ANT_BURN_WIRE_2  (via drill 0.45)
  Top 0.508: 224.79,99.08 224.79,92.71 224.63,92.71 224.03,92.11 222.21,92.11 H1_COMM.25
  Top 0.762: v123.19,370.84 MISC_TEST.2 | v219.71,304.8 189.23,304.8 v147.32,346.71 | v219.71,233.68 224.79,228.6 224.79,99.08
  Bottom 0.508: 219.71,247.67 219.71,238.76 | 219.71,347.98 219.71,346.71
  Bottom 0.762: H1_OBC.25 219.71,348.62 219.71,347.98 | v147.32,346.71 v123.19,370.84 | 219.71,346.71 v219.71,304.8 219.71,247.67 | 219.71,238.76 v219.71,233.68
ARDUINO_1_PWR
  Top 0.762: ARDUINO_1.2 135.89,321.31 133.35,318.77 133.35,297.18 135.89,294.64 139.32,294.64 ARDUINO_1_PWR.1 LED1.A
ARDUINO_1_SCL
  Bottom 0.762: ARDUINO_TEST1.9 43.18,365.76 113.03,295.91 113.03,276.86 116.84,273.05 ARDUINO_IN_1.2
ARDUINO_1_SDA
  Bottom 0.762: ARDUINO_TEST1.10 45.72,368.3 115.57,298.45 115.57,278.13 118.11,275.59 ARDUINO_IN_1.1
ARDUINO_2_PWR  (1 unrouted)
  Top 0.762: ARDUINO_2_PWR.1 139.32,228.6 135.89,228.6 133.35,231.14 133.35,252.73 135.89,255.27 ARDUINO_2.2
ARDUINO_2_SCL
  Bottom 0.762: ARDUINO_TEST1.7 38.1,360.68 99.06,299.72 99.06,223.52 115.57,207.01 ARDUINO_IN_2.2
ARDUINO_2_SDA
  Bottom 0.762: ARDUINO_TEST1.8 40.64,363.22 101.6,302.26 101.6,226.06 118.11,209.55 ARDUINO_IN_2.1
ARDUINO_3_PWR
  Top 0.762: ARDUINO_3.2 135.89,189.23 133.35,186.69 133.35,165.1 135.89,162.56 139.32,162.56 ARDUINO_3_PWR.1 LED3.A
ARDUINO_3_SCL
  Bottom 0.762: ARDUINO_TEST1.5 33.02,355.6 93.98,294.64 93.98,162.56 115.57,140.97 ARDUINO_IN_3.2
ARDUINO_3_SDA
  Bottom 0.762: ARDUINO_TEST1.6 35.56,358.14 96.52,297.18 96.52,165.1 118.11,143.51 ARDUINO_IN_3.1
ARDUINO_4_PWR
  Top 0.762: ARDUINO_4.2 135.89,123.19 133.35,120.65 133.35,99.06 135.51,96.9 ARDUINO_4_PWR.1 LED4.A
ARDUINO_4_SCL
  Bottom 0.762: ARDUINO_TEST1.3 27.94,350.52 88.9,289.56 88.9,101.6 115.57,74.93 ARDUINO_IN_4.2
ARDUINO_4_SDA
  Bottom 0.762: ARDUINO_TEST1.4 30.48,353.06 91.44,292.1 91.44,104.14 118.11,77.47 ARDUINO_IN_4.1 140.97,77.47
ARDUINO_5_PWR
  Top 0.762: ARDUINO_5.2 135.89,57.15 133.35,54.61 133.35,33.02 135.89,30.48 139.32,30.48 ARDUINO_5_PWR.1 LED5.A
ARDUINO_5_SCL
  Bottom 0.762: ARDUINO_TEST1.1 22.86,345.44 83.82,284.48 83.82,40.64 115.57,8.89 ARDUINO_IN_5.2
ARDUINO_5_SDA
  Bottom 0.762: ARDUINO_TEST1.2 25.4,347.98 86.36,287.02 86.36,43.18 118.11,11.43 ARDUINO_IN_5.1
ARUINO_MAIN_PWR  (via drill 0.45)
  Top 0.762: ADDUINO_PWR.1 30.48,388.62 38.73,380.37 | 38.73,380.37 v119.38,299.72 v119.38,233.68 v119.38,167.64 v119.38,101.6 v119.38,38.1 | 38.73,380.37 29.21,370.84 ARDUINO_TEST1.11
  Bottom 0.762: v119.38,299.72 ARDUINO_1_PWR.2 | ARDUINO_2_PWR.2 v119.38,233.68 | ARDUINO_3_PWR.2 v119.38,167.64 | ARDUINO_4_PWR.2 v119.38,101.6 | ARDUINO_5_PWR.2 121.92,35.56 v119.38,38.1
BCR_OUT  (via drill 0.45)
  Top 0.762: 242.57,354.96 H2_OBC.43 H2_OBC.44 H2_OBC.42 H2_OBC.41 242.57,354.96 | 242.57,354.96 242.57,375.92 232.41,386.08 v186.69,386.08 | v130.81,408.94 MISC_TEST.5
  Bottom 0.762: v186.69,386.08 186.69,406.4 184.15,408.94 v130.81,408.94
DTR  (via drill 0.45)
  Top 0.508: 196.85,348.62 196.85,346.71
  Top 0.762: H1_OBC.5 196.85,348.62 | 196.85,346.71 196.85,318.77 200.66,314.96 v250.19,314.96 271.78,293.37 271.78,115.57 274.84,112.51 CIA.5 | v120.65,421.64 MISC_TEST.1
  Bottom 0.762: v250.19,314.96 281.94,346.71 281.94,368.3 228.6,421.64 v120.65,421.64
GND  (50 unrouted)
  pour Top (isolate 0.305): -13.97,558.8 -13.97,-13.97 -2.54,-25.4 528.32,-25.4 538.48,-15.24 538.48,554.99 523.24,570.23 -2.54,570.23
  pour Bottom (isolate 0.305): -1.27,576.58 -19.05,558.8 -19.05,11.01 27.52,-35.56 547.37,-35.56 547.37,553.72 524.51,576.58
GND1  (via drill 0.45)
  other vias: 270.51,332.74
GND2  (via drill 0.45)
  other vias: 275.59,332.74
GND3  (via drill 0.45)
  other vias: 275.59,337.82
GND4  (via drill 0.45)
  other vias: 280.67,337.82
GND5  (via drill 0.45)
  other vias: 270.51,327.66
GND6  (via drill 0.45)  (1 unrouted)
  other vias: 265.43,322.58 270.51,317.5
GND7  (via drill 0.45)  (1 unrouted)
  other vias: 260.35,317.5 265.43,317.5
GND8  (via drill 0.45)
  other vias: 255.27,312.42
GND9  (via drill 0.45)
  other vias: 250.19,307.34
GND10  (via drill 0.45)
  other vias: 250.19,312.42
GND11  (via drill 0.45)
  other vias: 255.27,317.5
GND12  (via drill 0.45)
  other vias: 260.35,322.58
GND13  (via drill 0.45)
  other vias: 265.43,327.66
GND14  (via drill 0.45)
  other vias: 275.59,327.66
GND15  (via drill 0.45)  (1 unrouted)
  other vias: 270.51,322.58 275.59,322.58
GND16  (via drill 0.45)
  other vias: 260.35,307.34
GND17  (via drill 0.45)
  other vias: 255.27,302.26
GND18  (via drill 0.45)
  other vias: 255.27,307.34
GND19  (via drill 0.45)
  other vias: 260.35,302.26
GND20  (via drill 0.45)
  other vias: 270.51,312.42
GND21  (via drill 0.45)
  other vias: 265.43,307.34
GND22  (via drill 0.45)  (1 unrouted)
  other vias: 265.43,312.42 260.35,312.42
GND23  (via drill 0.45)
  other vias: 270.51,307.34
GND24  (via drill 0.45)  (8 unrouted)
  other vias: 280.67,317.5 285.75,317.5 290.83,317.5 295.91,317.5 290.83,322.58 295.91,322.58 290.83,327.66 285.75,312.42 290.83,312.42
GND25  (via drill 0.45)
  other vias: 275.59,312.42
GND26  (via drill 0.45)
  other vias: 275.59,317.5
GND27  (via drill 0.45)
  other vias: 280.67,312.42
GND28  (via drill 0.45)
  other vias: 285.75,327.66
GND29  (via drill 0.45)
  other vias: 280.67,322.58
GND30  (via drill 0.45)  (1 unrouted)
  other vias: 280.67,327.66 280.67,332.74
GND31  (via drill 0.45)
  other vias: 285.75,322.58
GND32  (via drill 0.45)
  other vias: 290.83,337.82
GND33  (via drill 0.45)
  other vias: 285.75,332.74
GND34  (via drill 0.45)  (1 unrouted)
  other vias: 246.38,316.23 246.38,311.15
GND35  (via drill 0.45)
  other vias: 246.38,321.31
GND36  (via drill 0.45)
  other vias: 246.38,326.39
GND37  (via drill 0.45)  (13 unrouted)
  other vias: 246.38,331.47 242.57,328.93 242.57,323.85 242.57,318.77 242.57,313.69 238.76,316.23 238.76,321.31 238.76,311.15 234.95,313.69 234.95,318.77 234.95,323.85 234.95,328.93 234.95,308.61 229.87,311.15
GND38  (via drill 0.45)  (1 unrouted)
  other vias: 246.38,336.55 242.57,334.01
GND39  (via drill 0.45)  (1 unrouted)
  other vias: 246.38,341.63 242.57,339.09
GND40  (via drill 0.45)
  other vias: 250.19,339.09
GND41  (via drill 0.45)
  other vias: 250.19,334.01
GND42  (via drill 0.45)
  other vias: 250.19,328.93
GND43  (via drill 0.45)
  other vias: 250.19,323.85
GND44  (via drill 0.45)
  other vias: 250.19,318.77
GND45  (via drill 0.45)
  other vias: 285.75,337.82
GND46  (via drill 0.45)
  other vias: 254,336.55
GND47  (via drill 0.45)
  other vias: 254,341.63
GND48  (via drill 0.45)
  other vias: 254,331.47
GND49  (via drill 0.45)
  other vias: 254,326.39
GND50  (via drill 0.45)
  other vias: 254,321.31
GND51  (via drill 0.45)
  other vias: 257.81,328.93
GND52  (via drill 0.45)
  other vias: 257.81,334.01
GND53  (via drill 0.45)
  other vias: 257.81,339.09
GND54  (via drill 0.45)
  other vias: 261.62,341.63
GND55  (via drill 0.45)
  other vias: 261.62,336.55
GND56  (via drill 0.45)
  other vias: 261.62,331.47
GND57  (via drill 0.45)  (1 unrouted)
  other vias: 229.87,316.23 229.87,321.31
GND58  (via drill 0.45)
  other vias: 265.43,339.09
GND59  (via drill 0.45)
  other vias: 265.43,334.01
GND60  (via drill 0.45)
  other vias: 265.43,344.17
GND61  (via drill 0.45)
  other vias: 257.81,344.17
GND62  (via drill 0.45)
  other vias: 250.19,344.17
GND63  (via drill 0.45)
  other vias: 290.83,332.74
GND64  (via drill 0.45)
  other vias: 270.51,341.63
GND65  (via drill 0.45)
  other vias: 270.51,302.26
GND66  (via drill 0.45)
  other vias: 274.32,344.17
GND67  (via drill 0.45)  (3 unrouted)
  other vias: 265.43,297.18 260.35,297.18 265.43,292.1 270.51,292.1
GND68  (via drill 0.45)
  other vias: 265.43,302.26
GND69  (via drill 0.45)  (1 unrouted)
  other vias: 270.51,297.18 275.59,297.18
GND70  (via drill 0.45)
  other vias: 280.67,307.34
GND71  (via drill 0.45)
  other vias: 275.59,302.26
GND72  (via drill 0.45)
  other vias: 229.87,326.39
GND73  (via drill 0.45)
  other vias: 238.76,326.39
GND74  (via drill 0.45)
  other vias: 229.87,331.47
GND75  (via drill 0.45)
  other vias: 229.87,336.55
GND76  (via drill 0.45)
  other vias: 275.59,307.34
GND77  (via drill 0.45)
  other vias: 234.95,339.09
GND78  (via drill 0.45)
  other vias: 234.95,334.01
GND79  (via drill 0.45)
  other vias: 234.95,344.17
GND80  (via drill 0.45)
  other vias: 280.67,302.26
GND81  (via drill 0.45)
  other vias: 172.72,334.01
GND82  (via drill 0.45)
  other vias: 167.64,328.93
GND83  (via drill 0.45)
  other vias: 167.64,334.01
GND84  (via drill 0.45)  (2 unrouted)
  other vias: 172.72,328.93 172.72,323.85 177.8,323.85
GND85  (via drill 0.45)  (1 unrouted)
  other vias: 182.88,334.01 187.96,334.01
GND86  (via drill 0.45)  (1 unrouted)
  other vias: 177.8,328.93 172.72,318.77
GND87  (via drill 0.45)  (1 unrouted)
  other vias: 177.8,334.01 182.88,339.09
GND88  (via drill 0.45)
  other vias: 182.88,328.93
GND89  (via drill 0.45)
  other vias: 177.8,344.17
GND90  (via drill 0.45)  (3 unrouted)
  other vias: 167.64,339.09 172.72,339.09 162.56,334.01 162.56,328.93
GND91  (via drill 0.45)
  other vias: 172.72,344.17
GND92  (via drill 0.45)
  other vias: 177.8,339.09
GND93  (via drill 0.45)
  other vias: 167.64,323.85
GND94  (via drill 0.45)  (2 unrouted)
  other vias: 162.56,318.77 162.56,313.69 162.56,308.61
GND95  (via drill 0.45)
  other vias: 162.56,323.85
GND96  (via drill 0.45)  (5 unrouted)
  other vias: 167.64,318.77 167.64,313.69 165.1,300.99 162.56,303.53 162.56,298.45 165.1,295.91
GND97  (via drill 0.45)  (3 unrouted)
  other vias: 165.1,290.83 162.56,293.37 162.56,288.29 165.1,285.75
GND98  (via drill 0.45)  (2 unrouted)
  other vias: 165.1,280.67 162.56,283.21 162.56,278.13
GND99  (via drill 0.45)  (3 unrouted)
  other vias: 165.1,270.51 162.56,273.05 162.56,267.97 165.1,265.43
GND100  (via drill 0.45)  (3 unrouted)
  other vias: 270.51,284.48 267.97,287.02 267.97,281.94 270.51,279.4
GND101  (via drill 0.45)  (3 unrouted)
  other vias: 275.59,284.48 273.05,287.02 273.05,281.94 275.59,279.4
GND102  (via drill 0.45)  (3 unrouted)
  other vias: 270.51,274.32 267.97,276.86 267.97,271.78 270.51,269.24
GND103  (via drill 0.45)  (3 unrouted)
  other vias: 275.59,274.32 273.05,276.86 273.05,271.78 275.59,269.24
GND104  (via drill 0.45)  (3 unrouted)
  other vias: 278.13,292.1 275.59,294.64 275.59,289.56 278.13,287.02
GND105  (via drill 0.45)  (3 unrouted)
  other vias: 283.21,292.1 280.67,294.64 280.67,289.56 283.21,287.02
GND106  (via drill 0.45)  (3 unrouted)
  other vias: 288.29,292.1 285.75,294.64 285.75,289.56 288.29,287.02
GND107  (via drill 0.45)  (3 unrouted)
  other vias: 293.37,292.1 290.83,294.64 290.83,289.56 293.37,287.02
GND108  (via drill 0.45)  (3 unrouted)
  other vias: 270.51,264.16 267.97,266.7 267.97,261.62 270.51,259.08
GND109  (via drill 0.45)  (3 unrouted)
  other vias: 275.59,264.16 273.05,266.7 273.05,261.62 275.59,259.08
GND110  (via drill 0.45)  (3 unrouted)
  other vias: 270.51,254 267.97,256.54 267.97,251.46 270.51,248.92
GND111  (via drill 0.45)  (3 unrouted)
  other vias: 275.59,254 273.05,256.54 273.05,251.46 275.59,248.92
GND112  (via drill 0.45)  (3 unrouted)
  other vias: 270.51,243.84 267.97,246.38 267.97,241.3 270.51,238.76
GND113  (via drill 0.45)  (3 unrouted)
  other vias: 275.59,243.84 273.05,246.38 273.05,241.3 275.59,238.76
GND114  (via drill 0.45)  (3 unrouted)
  other vias: 270.51,233.68 267.97,236.22 267.97,231.14 270.51,228.6
GND115  (via drill 0.45)  (2 unrouted)
  other vias: 275.59,233.68 273.05,236.22 273.05,231.14
GND116  (via drill 0.45)  (3 unrouted)
  other vias: 267.97,218.44 265.43,220.98 265.43,215.9 267.97,213.36
GND117  (via drill 0.45)  (3 unrouted)
  other vias: 273.05,218.44 270.51,220.98 270.51,215.9 273.05,213.36
GND118  (via drill 0.45)  (3 unrouted)
  other vias: 267.97,208.28 265.43,210.82 265.43,205.74 267.97,203.2
GND119  (via drill 0.45)  (3 unrouted)
  other vias: 273.05,208.28 270.51,210.82 270.51,205.74 273.05,203.2
GND120  (via drill 0.45)  (3 unrouted)
  other vias: 267.97,198.12 265.43,200.66 265.43,195.58 267.97,193.04
GND121  (via drill 0.45)  (3 unrouted)
  other vias: 273.05,198.12 270.51,200.66 270.51,195.58 273.05,193.04
GND122  (via drill 0.45)  (3 unrouted)
  other vias: 267.97,187.96 265.43,190.5 265.43,185.42 267.97,182.88
GND123  (via drill 0.45)  (3 unrouted)
  other vias: 273.05,187.96 270.51,190.5 270.51,185.42 273.05,182.88
GND124  (via drill 0.45)  (3 unrouted)
  other vias: 267.97,177.8 265.43,180.34 265.43,175.26 267.97,172.72
GND125  (via drill 0.45)  (3 unrouted)
  other vias: 273.05,177.8 270.51,180.34 270.51,175.26 273.05,172.72
GND126  (via drill 0.45)  (3 unrouted)
  other vias: 267.97,167.64 265.43,170.18 265.43,165.1 267.97,162.56
GND127  (via drill 0.45)  (3 unrouted)
  other vias: 273.05,167.64 270.51,170.18 270.51,165.1 273.05,162.56
GND128  (via drill 0.45)  (3 unrouted)
  other vias: 267.97,157.48 265.43,160.02 265.43,154.94 267.97,152.4
GND129  (via drill 0.45)  (3 unrouted)
  other vias: 273.05,157.48 270.51,160.02 270.51,154.94 273.05,152.4
GND130  (via drill 0.45)  (3 unrouted)
  other vias: 267.97,147.32 265.43,149.86 265.43,144.78 267.97,142.24
GND131  (via drill 0.45)  (3 unrouted)
  other vias: 273.05,147.32 270.51,149.86 270.51,144.78 273.05,142.24
GND132  (via drill 0.45)  (1 unrouted)
  other vias: 265.43,284.48 265.43,279.4
GND133  (via drill 0.45)  (1 unrouted)
  other vias: 265.43,274.32 265.43,269.24
GND134  (via drill 0.45)  (1 unrouted)
  other vias: 265.43,264.16 265.43,259.08
GND135  (via drill 0.45)  (1 unrouted)
  other vias: 265.43,254 265.43,248.92
GND136  (via drill 0.45)  (1 unrouted)
  other vias: 265.43,243.84 265.43,238.76
GND137  (via drill 0.45)  (1 unrouted)
  other vias: 265.43,233.68 265.43,228.6
GND138  (via drill 0.45)
  other vias: 267.97,226.06
GND139  (via drill 0.45)
  other vias: 273.05,226.06
GND140  (via drill 0.45)  (3 unrouted)
  other vias: 288.29,280.67 285.75,283.21 285.75,278.13 288.29,275.59
GND141  (via drill 0.45)  (2 unrouted)
  other vias: 293.37,280.67 290.83,283.21 293.37,275.59
GND142  (via drill 0.45)
  other vias: 238.76,331.47
GND143  (via drill 0.45)
  other vias: 238.76,336.55
GND144  (via drill 0.45)
  other vias: 229.87,341.63
GND145  (via drill 0.45)
  other vias: 238.76,341.63
GND146  (via drill 0.45)
  other vias: 137.16,354.33
GND147  (via drill 0.45)
  other vias: 132.08,349.25
GND148  (via drill 0.45)
  other vias: 132.08,354.33
GND149  (via drill 0.45)  (1 unrouted)
  other vias: 137.16,349.25 137.16,344.17
GND150  (via drill 0.45)  (1 unrouted)
  other vias: 127,354.33 127,349.25
GND151  (via drill 0.45)
  other vias: 132.08,344.17
GND152  (via drill 0.45)
  other vias: 127,344.17
GND153  (via drill 0.45)
  other vias: 152.4,364.49
GND154  (via drill 0.45)
  other vias: 147.32,359.41
GND155  (via drill 0.45)
  other vias: 147.32,364.49
GND156  (via drill 0.45)  (1 unrouted)
  other vias: 152.4,359.41 152.4,354.33
GND157  (via drill 0.45)  (1 unrouted)
  other vias: 142.24,364.49 142.24,359.41
GND158  (via drill 0.45)
  other vias: 147.32,354.33
GND159  (via drill 0.45)
  other vias: 142.24,354.33
GND160  (via drill 0.45)
  other vias: 157.48,379.73
GND161  (via drill 0.45)
  other vias: 152.4,374.65
GND162  (via drill 0.45)
  other vias: 152.4,379.73
GND163  (via drill 0.45)  (1 unrouted)
  other vias: 157.48,374.65 157.48,369.57
GND164  (via drill 0.45)  (1 unrouted)
  other vias: 147.32,379.73 147.32,374.65
GND165  (via drill 0.45)
  other vias: 152.4,369.57
GND166  (via drill 0.45)
  other vias: 147.32,369.57
GND167  (via drill 0.45)
  other vias: 172.72,379.73
GND168  (via drill 0.45)
  other vias: 167.64,374.65
GND169  (via drill 0.45)
  other vias: 167.64,379.73
GND170  (via drill 0.45)  (1 unrouted)
  other vias: 172.72,374.65 172.72,369.57
GND171  (via drill 0.45)  (1 unrouted)
  other vias: 162.56,379.73 162.56,374.65
GND172  (via drill 0.45)
  other vias: 167.64,369.57
GND173  (via drill 0.45)
  other vias: 162.56,369.57
GND174  (via drill 0.45)
  other vias: 167.64,394.97
GND175  (via drill 0.45)
  other vias: 162.56,389.89
GND176  (via drill 0.45)
  other vias: 162.56,394.97
GND177  (via drill 0.45)  (1 unrouted)
  other vias: 167.64,389.89 167.64,384.81
GND178  (via drill 0.45)  (1 unrouted)
  other vias: 157.48,394.97 157.48,389.89
GND179  (via drill 0.45)
  other vias: 162.56,384.81
GND180  (via drill 0.45)
  other vias: 157.48,384.81
GND181  (via drill 0.45)
  other vias: 142.24,374.65
GND182  (via drill 0.45)
  other vias: 137.16,369.57
GND183  (via drill 0.45)
  other vias: 132.08,364.49
GND184  (via drill 0.45)
  other vias: 137.16,364.49
GND185  (via drill 0.45)
  other vias: 142.24,369.57
GND186  (via drill 0.45)
  other vias: 157.48,364.49
GND187  (via drill 0.45)
  other vias: 162.56,364.49
GND188  (via drill 0.45)
  other vias: 157.48,359.41
GND189  (via drill 0.45)
  other vias: 142.24,349.25
GND190  (via drill 0.45)
  other vias: 147.32,349.25
GND191  (via drill 0.45)
  other vias: 142.24,344.17
GND192  (via drill 0.45)
  other vias: 137.16,339.09
GND193  (via drill 0.45)
  other vias: 132.08,339.09
GND194  (via drill 0.45)
  other vias: 121.92,349.25
GND195  (via drill 0.45)
  other vias: 132.08,359.41
GND196  (via drill 0.45)
  other vias: 137.16,359.41
GND197  (via drill 0.45)
  other vias: 127,359.41
GND198  (via drill 0.45)
  other vias: 121.92,354.33
GND199  (via drill 0.45)
  other vias: 152.4,384.81
GND200  (via drill 0.45)
  other vias: 172.72,384.81
GND201  (via drill 0.45)
  other vias: 172.72,389.89
GND202  (via drill 0.45)
  other vias: 172.72,394.97
I2C1_SCL  (via drill 0.45)
  Top 0.508: 245.11,99.06 245.11,92.08 H1_COMM.44
  Top 0.762: v243.84,278.13 190.5,278.13 v134.62,334.01 | H1_PWR.44 243.84,238.12 245.11,236.85 245.11,99.06 | I2C_TEST1.4 v100.33,363.22
  Bottom 0.508: 245.11,247.67 245.11,240.66 H1_PWR.44
  Bottom 0.762: H1_OBC.44 v243.84,278.13 243.84,250.19 245.11,248.92 245.11,247.67 | v134.62,334.01 105.41,363.22 v100.33,363.22
I2C1_SDA  (via drill 0.45)
  Top 0.508: 240.03,99.08 240.03,92.08 H1_COMM.42
  Top 0.762: I2C_TEST1.1 v92.71,365.76 | v137.16,336.55 179.07,294.64 v241.3,294.64 | H1_PWR.42 241.3,101.62 240.03,100.35 240.03,99.08
  Bottom 0.508: 240.03,247.67 240.03,241.3 241.3,240.03 H1_PWR.42
  Bottom 0.762: H1_OBC.42 v241.3,294.64 241.3,250.19 240.03,248.92 240.03,247.67 | v137.16,336.55 107.95,365.76 v92.71,365.76
I2C2_SCL  (via drill 0.45)
  Top 0.508: 234.95,351.15 234.95,355.6 236.22,356.87
  Top 0.762: H1_OBC.37 234.95,351.15 | v128.27,120.65 v128.27,186.69 v128.27,252.73 128.27,337.82 173.99,383.54 v184.15,383.54 229.87,383.54 236.22,377.19 236.22,356.87 | I2C_TEST1.5 v102.87,406.4
  Bottom 0.762: ARDUINO_4.3 v128.27,120.65 | ARDUINO_3.3 v128.27,186.69 | ARDUINO_2.3 v128.27,252.73 | v184.15,383.54 184.15,403.86 181.61,406.4 v102.87,406.4
I2C2_SDA  (via drill 0.45)
  Top 0.508: 232.41,351.15 232.41,355.6 231.14,356.87
  Top 0.762: H1_OBC.35 232.41,351.15 | v130.81,118.11 v130.81,184.15 v130.81,250.19 130.81,335.28 173.99,378.46 v179.07,378.46 224.79,378.46 231.14,372.11 231.14,356.87 | I2C_TEST1.2 v95.25,401.32
  Bottom 0.762: ARDUINO_4.4 v130.81,118.11 | ARDUINO_3.4 v130.81,184.15 | ARDUINO_2.4 v130.81,250.19 | v179.07,378.46 179.07,398.78 176.53,401.32 100.33,401.32 99.06,401.32 v95.25,401.32
I2C3_SCL  (via drill 0.45)
  Top 0.508: 252.73,351.15 252.73,375.92 | ARDUINO_5.3 227.33,54.61 262.89,90.17 262.89,106.68 267.22,111.01 CIA.6
  Top 0.762: H1_OBC.51 252.73,351.15 | 252.73,375.92 237.49,391.16 v191.77,391.16 171.45,391.16 123.19,342.9 v123.19,54.61 | I2C_TEST1.6 v105.41,414.02
  Bottom 0.762: v191.77,391.16 191.77,411.48 189.23,414.02 v105.41,414.02 | v123.19,54.61 ARDUINO_5.3
I2C3_SDA  (via drill 0.45)
  Top 0.508: 250.31,351.95 250.31,356.75 | ARDUINO_5.4 229.87,52.07 266.7,88.9 266.7,104.14 270.51,107.95 303.53,107.95 305.09,109.51 CIA.7
  Top 0.762: H1_OBC.49 251.46,350.79 250.31,351.95 | 250.19,356.87 250.31,356.75 250.31,373.26 234.95,388.62 v189.23,388.62 173.99,388.62 125.73,340.36 v125.73,52.07 | I2C_TEST1.3 v97.79,411.48
  Bottom 0.762: v189.23,388.62 189.23,408.94 186.69,411.48 v97.79,411.48 | v125.73,52.07 ARDUINO_5.4
N$1
  Top 0.762: R2.1 LED2.K
N$2
  Top 0.762: LED1.K R1.1
N$3
  Top 0.762: R3.1 LED3.K
N$4
  Top 0.762: R4.1 LED4.K
N$5
  Top 0.762: LED5.K R5.1
N$6
  Bottom 0.508: 0,10.16 0,0
PCM_IN  (via drill 0.45)
  Top 0.762: H2_OBC.36 H2_OBC.35 233.68,374.65 227.33,381 v181.61,381 | v128.27,403.86 MISC_TEST.4
  Bottom 0.762: v181.61,381 181.61,401.32 179.07,403.86 v128.27,403.86
PH5_NEG  (via drill 0.45)  (1 unrouted)
  Top 0.508: 237.49,99.08 237.49,92.08 H1_COMM.38
  Top 0.762: v139.7,339.09 181.61,297.18 v236.22,297.18 | v237.49,233.68 237.49,99.08
  Bottom 0.508: 237.49,247.65 237.49,238.76
  Bottom 0.762: v139.7,339.09 110.49,368.3 55.88,368.3 17.78,406.4 JP1.1 | H1_OBC.38 v236.22,297.18 236.22,251.46 237.49,250.19 237.49,247.67 | 237.49,238.76 v237.49,233.68
PH5_POS  (via drill 0.45)
  Top 0.508: 232.41,99.08 232.41,92.08 H1_COMM.36
  Top 0.762: v142.24,341.63 184.15,299.72 v233.68,299.72 | v232.41,233.68 232.41,99.08
  Bottom 0.508: 233.68,248.92 232.41,247.65 232.41,238.76
  Bottom 0.762: H1_OBC.36 v233.68,299.72 233.68,248.92 | v142.24,341.63 113.03,370.84 58.42,370.84 20.32,408.94 JP1.2 | 232.41,238.76 v232.41,233.68
SPI_EN_1  (via drill 0.35, 0.45)
  Top 0.508: 199.39,348.62 199.39,346.71
  Top 0.762: H1_OBC.7 199.39,348.62 | 199.39,346.71 199.39,326.39 205.74,320.04 255.27,320.04 v262.89,312.42 276.86,298.45 v276.86,267.97 | v302.26,267.97 309.42,275.13 RWA_1.2
  Bottom 0.762: SPI_TEST1.1 257.81,406.4 289.56,374.65 289.56,339.09 v262.89,312.42 | v276.86,267.97 v302.26,267.97
SPI_EN_2  (via drill 0.45)
  Top 0.762: H1_OBC.8 198.12,322.58 203.2,317.5 252.73,317.5 v262.89,307.34 274.32,295.91 v274.32,229.87 | RWA_2.2 309.42,234.49 304.8,229.87 v302.26,229.87
  Bottom 0.762: SPI_TEST1.2 260.35,408.94 292.1,377.19 292.1,336.55 v262.89,307.34 | v302.26,229.87 v274.32,229.87
SPI_EN_3  (via drill 0.45)
  Top 0.762: H1_OBC.22 215.9,342.9 218.44,340.36 275.59,340.36 v288.29,327.66 297.18,318.77 v297.18,189.23 | RWA_3.2 309.42,193.85 304.8,189.23 v302.26,189.23
  Bottom 0.762: SPI_TEST1.3 262.89,411.48 294.64,379.73 294.64,334.01 v288.29,327.66 | v302.26,189.23 v297.18,189.23
SPI_EN_4  (via drill 0.45)
  Top 0.508: 217.17,348.62 217.17,345.44
  Top 0.762: H1_OBC.21 217.17,348.62 | 217.17,345.44 219.71,342.9 278.13,342.9 v293.37,327.66 299.72,321.31 299.72,163.83 299.72,162.56 299.72,151.13 302.26,148.59 305.21,148.59 309.83,153.21 RWA_4.2
  Bottom 0.762: SPI_TEST1.4 265.43,414.02 297.18,382.27 297.18,331.47 v293.37,327.66
SPI_MISO  (via drill 0.35, 0.45)
  Top 0.762: H1_OBC.18 210.82,336.55 214.63,332.74 267.97,332.74 v288.29,312.42 289.56,311.15 v289.56,278.13 v289.56,237.49 v289.56,196.85 v289.56,156.21 | v302.26,278.13 RWA_1.4 | RWA_2.4 v302.26,237.49 | RWA_3.4 v302.26,196.85 | RWA_4.4 v302.26,156.21
  Bottom 0.762: SPI_TEST1.6 270.51,419.1 302.26,387.35 302.26,326.39 v288.29,312.42 | v289.56,278.13 v302.26,278.13 | v302.26,237.49 v289.56,237.49 | v302.26,196.85 v289.56,196.85 | v302.26,156.21 v289.56,156.21
SPI_MOSI  (via drill 0.35, 0.45)
  Top 0.762: H1_OBC.16 208.28,335.28 213.36,330.2 265.43,330.2 v283.21,312.42 287.02,308.61 v287.02,274.32 v287.02,233.68 v287.02,193.04 v287.02,152.4 | v302.26,274.32 304.57,276.63 RWA_1.3 | RWA_2.3 307.11,235.99 304.8,233.68 v302.26,233.68 | RWA_3.3 309.65,195.58 307.34,195.58 304.8,193.04 v302.26,193.04 | RWA_4.3 309.65,154.94 307.34,154.94 304.8,152.4 v302.26,152.4
  Bottom 0.762: SPI_TEST1.5 267.97,416.56 299.72,384.81 299.72,328.93 v283.21,312.42 | v287.02,274.32 v302.26,274.32 | v302.26,233.68 v287.02,233.68 | v302.26,193.04 v287.02,193.04 | v287.02,152.4 v302.26,152.4
SPI_SCK  (via drill 0.45)
  Top 0.762: H1_OBC.12 203.2,336.55 212.09,327.66 262.89,327.66 284.48,306.07 v284.48,304.8 v284.48,281.94 v284.48,241.3 v284.48,200.66 v284.48,160.02 284.48,154.94 | RWA_1.5 304.57,279.63 v302.26,281.94 | RWA_2.5 307.11,238.99 304.8,241.3 v302.26,241.3 | RWA_3.5 308.38,198.35 306.07,200.66 v302.26,200.66 | RWA_4.5 307.11,157.71 304.8,160.02 v302.26,160.02
  Bottom 0.762: SPI_TEST1.7 273.05,421.64 304.8,389.89 304.8,309.88 299.72,304.8 v284.48,304.8 | v302.26,241.3 v284.48,241.3 | v302.26,281.94 v284.48,281.94 | v302.26,200.66 v284.48,200.66 | v302.26,160.02 v284.48,160.02
SPI_SS_1  (via drill 0.45)
  Top 0.508: 201.93,348.62 201.93,346.71
  Top 0.762: H1_OBC.9 201.93,348.62 | 201.93,346.71 201.93,332.74 209.55,325.12 260.35,325.12 281.94,303.53 v281.94,302.26 v281.94,285.75 | RWA_1.6 309.42,281.13 304.8,285.75 v302.26,285.75
  Bottom 0.762: SPI_TEST1.8 275.59,424.18 307.34,392.43 307.34,307.34 302.26,302.26 v281.94,302.26 | v302.26,285.75 v281.94,285.75
SPI_SS_2  (via drill 0.45)
  Top 0.762: H1_OBC.10 200.66,330.2 208.28,322.58 257.81,322.58 279.4,300.99 v279.4,299.72 279.4,248.92 279.4,247.65 v279.4,245.11 | RWA_2.6 309.21,241.16 309.16,241.16 305.21,245.11 v302.26,245.11
  Bottom 0.762: SPI_TEST1.9 278.13,426.72 309.88,394.97 309.88,304.8 304.8,299.72 v279.4,299.72 | v302.26,245.11 v279.4,245.11
SPI_SS_3  (via drill 0.45)
  Top 0.762: H1_OBC.20 213.36,340.36 218.44,335.28 270.51,335.28 292.1,313.69 v292.1,297.18 v292.1,204.47 | RWA_3.6 309.21,200.52 309.16,200.52 305.21,204.47 v302.26,204.47
  Bottom 0.762: SPI_TEST1.10 280.67,429.26 312.42,397.51 312.42,302.26 307.34,297.18 v292.1,297.18 | v302.26,204.47 v292.1,204.47
SPI_SS_4  (via drill 0.45)
  Top 0.508: 214.63,347.98 214.63,346.71
  Top 0.762: H1_OBC.19 214.63,348.62 214.63,347.98 | 214.63,346.71 214.63,341.63 218.44,337.82 273.05,337.82 294.64,316.23 v294.64,294.64 v294.64,163.83 | RWA_4.6 309.21,159.88 309.16,159.88 305.21,163.83 v302.26,163.83
  Bottom 0.762: SPI_TEST1.11 283.21,431.8 314.96,400.05 314.96,299.72 309.88,294.64 v294.64,294.64 | v302.26,163.83 v294.64,163.83
UART1_RX  (via drill 0.35, 0.45)
  Top 0.762: H1_COMM.4 187.32,85.09 v163.83,85.09 | v187.96,331.47 v160.02,359.41 | UART_TEST1.4 71.12,417.83 88.9,400.05 v88.9,383.54
  Bottom 0.762: H1_OBC.4 193.04,336.55 v187.96,331.47 163.83,307.34 v163.83,85.09 | v160.02,359.41 135.89,383.54 v88.9,383.54
UART1_TX  (via drill 0.35, 0.45)
  Top 0.762: H1_COMM.2 187.32,87.63 v161.29,87.63 | v187.96,336.55 v162.56,361.95 | UART_TEST1.1 63.5,415.29 81.28,397.51 v81.28,386.08
  Bottom 0.762: v161.29,87.63 161.29,309.88 v187.96,336.55 190.5,339.09 H1_OBC.2 | v162.56,361.95 138.43,386.08 v81.28,386.08
UART3_RX  (via drill 0.45)
  Top 0.762: H1_OBC.52 260.71,347.35 264.05,350.68 264.05,369.69 240.03,393.7 v194.31,393.7 168.91,393.7 120.65,345.44 v120.65,317.5 | UART_TEST1.5 73.66,419.1 76.2,416.56 v77.47,416.56
  Bottom 0.762: v194.31,393.7 194.31,414.02 191.77,416.56 v77.47,416.56 | v120.65,317.5 121.92,316.23 ARDUINO_1.4
UART3_TX  (via drill 0.45)
  Top 0.762: H1_OBC.50 253.37,345.44 264.16,345.44 267.97,349.25 267.97,370.84 242.57,396.24 v196.85,396.24 166.37,396.24 118.11,347.98 v118.11,320.04 | UART_TEST1.2 v66.04,419.1
  Bottom 0.762: v196.85,396.24 196.85,416.56 194.31,419.1 v66.04,419.1 | v118.11,320.04 127,320.04 128.27,318.77 ARDUINO_1.3
UART4_RX  (via drill 0.35 pad 0.55, 0.45)
  Top 0.508: 193.99,348.93 194.31,348.62 194.31,345.44
  Top 0.762: H1_OBC.3 193.99,348.93 | 194.31,345.44 194.31,316.23 198.12,312.42 247.65,312.42 v252.73,307.34 269.24,290.83 v269.24,120.65 | CIA.4 306.5,114.01 305.24,115.28 305.24,118.94 304.8,119.38 v297.18,119.38 | UART_TEST1.6 76.2,429.26 78.74,426.72 v82.55,426.72
  Bottom 0.762: v269.24,120.65 270.51,119.38 v297.18,119.38 | v252.73,307.34 287.02,341.63 287.02,373.38 233.68,426.72 v82.55,426.72
UART4_TX  (via drill 0.35 pad 0.55, 0.45)  (1 unrouted)
  Top 0.508: 191.77,348.62 191.77,346.71
  Top 0.762: H1_OBC.1 191.77,348.62 | 191.77,346.71 191.77,314.96 196.85,309.88 245.11,309.88 v247.65,307.34 266.7,288.29 v266.7,134.62 | CIA.3 309.05,115.51 310.31,116.78 310.31,125.3 300.99,134.62 v299.72,134.62 | UART_TEST1.3 v68.58,424.18
  Bottom 0.762: v299.72,134.62 v266.7,134.62 | v247.65,307.34 284.48,344.17 284.48,370.84 275.59,379.73 | 276.23,379.1 231.14,424.18 v68.58,424.18

### Text on the board
tNames: PH5_NEG | PH5_POS | 3V3_PDM1 | 3V3_PDM2 | 3V3_PDM3 | 5V_PDM4 | 5V_PDM5 | 5V_PDM6 | 3V3_BUS | 5V_BUS | 12V_BUS | GND | UART1_TX | UART3_TX | UART4_TX | UART1_RX | UART3_RX | UART4_RX | GND | I2C1_SDA | I2C3_SDA | I2C2_SCL | I2C2_SDA | I2C1_SCL | I2C3_SCL | GND | DTR | ANT_BURN2 | ANT_BURN1 | PCM_IN | BRC_OUT | SPI_EN_1 | SPI_EN_2 | SPI_EN_3 | SPI_EN_4 | SPI_MOSI | SPI_MISO | SPI_SCK | SPI_SS_1 | SPI_SS_2 | SPI_SS_3 | SPI_SS_4 | GND | 3.3V | GND | GND | ARDUINO_3.3V | ARDUINO_1_SDA | ARDUINO_1_SCL | ARDUINO_2_SDA | ARDUINO_2_SCL | ARDUINO_3_SDA | ARDUINO_3_SCL | ARDUINO_4_SDA | ARDUINO_4_SCL | ARDUINO_5_SDA | ARDUINO_5_SCL | GND | ARDUINO_3.3V | UART3_TX | UART3_RX | OBC | ARDUINO_1 | ARDUINO_1_SDA | ARDUINO_1_SCL | GND | ARDUINO_3.3V | I2C2_SCL | I2C2_SDA | ARDUINO_2 | ARDUINO_2_SDA | ARDUINO_2_SCL | EPS | GND | ARDUINO_3.3V | I2C2_SCL | I2C2_SDA | ARDUINO_3 | ARDUINO_3_SDA | ARDUINO_3_SCL | GND | ARDUINO_3.3V | I2C2_SCL | I2C2_SDA | ARDUINO_4 | ARDUINO_4_SDA | ARDUINO_4_SCL | GND | COM_R | ARDUINO_3.3V | I2C3_SCL | I2C3_SDA | ARDUINO_5 | ARDUINO_5_SDA | ARDUINO_5_SCL
bNames: FLATSAT TEST MODULE REV 1 | Collin Pernu, UW AACT, 2-21-2021